# Altium project TI_RTB_integrated1.PrjPcb (part 1 of 2)
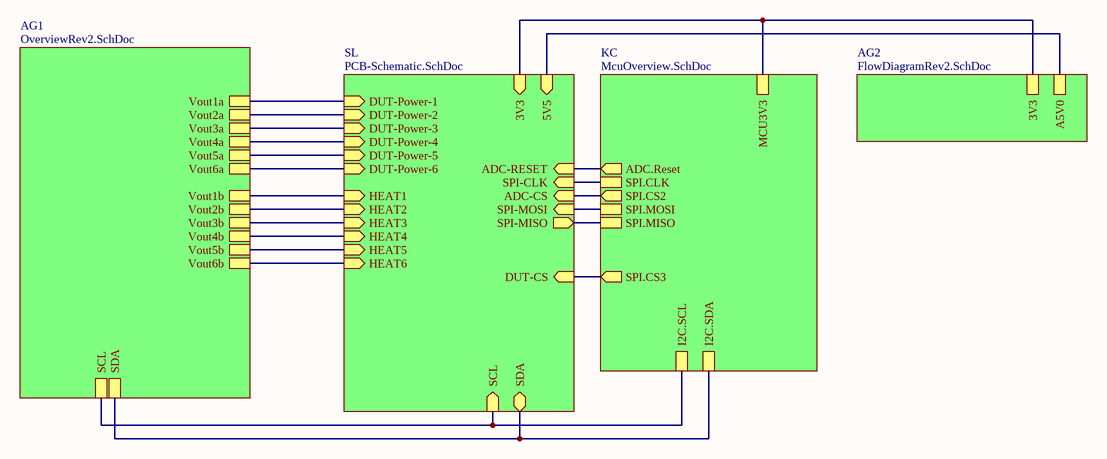
[diagram p0: overviewSchematic.SchDoc]
14 sheets, 185 parts. Net scope: hierarchical (ports join the sheet entries above them; power ports are global).
Board file: intPCB1.PcbDoc
Sheets:
  overviewSchematic.SchDoc
    KC = McuOverview.SchDoc
      U_EthernetSheet = EthernetSheet.SchDoc
      Designator = RadationTestBoardMCU.SchDoc
      Designator = PowerFilters.SchDoc
    SL = PCB-Schematic.SchDoc
      ADC = ADC.SchDoc
      VRB = VRB.SchDoc
      Current Sense = CurrentSense.SchDoc
      Heat Element = HeatElement.SchDoc
      Thermistors = Thermistor.SchDoc
      DUT1 = Headers.SchDoc
      DUT2 = Headers.SchDoc
      DUT3 = Headers.SchDoc
      DUT4 = Headers.SchDoc
      DUT5 = Headers.SchDoc
      DUT6 = Headers.SchDoc
      VOLT = ADC.SchDoc
      VRB = VRB.SchDoc
    AG2 = FlowDiagramRev2.SchDoc
    AG1 = OverviewRev2.SchDoc

## Sheet overviewSchematic.SchDoc
size A; SheetNumber: 1; SheetTotal: 14

### Sub-sheets
AG1 = OverviewRev2.SchDoc: Vout4a, Vout5a, Vout6a, Vout4b, Vout5b, Vout6b, Vout1a, Vout1b, Vout2a, Vout2b, Vout3b, Vout3a, SCL, SDA
AG2 = FlowDiagramRev2.SchDoc: 3V3, A5V0
KC = McuOverview.SchDoc: I2C.SDA, I2C.SCL, SPI.CS3 (out), MCU3V3, SPI.CLK, SPI.MISO, SPI.MOSI, ADC.Reset (out), SPI.CS2 (out)
SL = PCB-Schematic.SchDoc: DUT-Power-1 (in), DUT-Power-2 (in), DUT-Power-3 (in), DUT-Power-4 (in), DUT-Power-5 (in), DUT-Power-6 (in), HEAT1 (in), HEAT2 (in), HEAT3 (in), HEAT4 (in), HEAT5 (in), HEAT6 (in), ADC-CS (in), SPI-MOSI (in), SPI-MISO (out), ADC-RESET (in), SPI-CLK (in), SDA (bidir), SCL (in), DUT-CS (in), 3V3 (in), 5V5 (in)

### Nets
3V3: sheet KC/MCU3V3, sheet SL/3V3, sheet AG2/3V3
A5V0: sheet SL/DUT-Power-1, sheet SL/DUT-Power-2, sheet SL/DUT-Power-3, sheet SL/DUT-Power-4, sheet SL/DUT-Power-5, sheet SL/DUT-Power-6, sheet SL/5V5, sheet AG2/A5V0, sheet AG1/Vout4a, sheet AG1/Vout5a, sheet AG1/Vout6a, sheet AG1/Vout1a, sheet AG1/Vout2a, sheet AG1/Vout3a
Pow.SCL: sheet KC/I2C.SCL, sheet SL/SCL, sheet AG1/SCL
Pow.SDA: sheet KC/I2C.SDA, sheet SL/SDA, sheet AG1/SDA
NetADC_ADC_19: sheet KC/ADC.Reset, sheet SL/ADC-RESET
NetADC_ADC_20: sheet KC/SPI.CLK, sheet SL/SPI-CLK
NetADC_ADC_21: sheet KC/SPI.CS2, sheet SL/ADC-CS
NetADC_ADC_23: sheet KC/SPI.MISO, sheet SL/SPI-MISO
NetADC_ADC_24: sheet KC/SPI.MOSI, sheet SL/SPI-MOSI
NetADC_VOLT_21: sheet KC/SPI.CS3, sheet SL/DUT-CS
NetC121_1: sheet SL/HEAT1, sheet AG1/Vout1b
NetC122_1: sheet SL/HEAT2, sheet AG1/Vout2b
NetC123_1: sheet SL/HEAT3, sheet AG1/Vout3b
NetC124_1: sheet SL/HEAT4, sheet AG1/Vout4b
NetC125_1: sheet SL/HEAT5, sheet AG1/Vout5b
NetC126_1: sheet SL/HEAT6, sheet AG1/Vout6b

## Sheet McuOverview.SchDoc
size A; SheetNumber: 11; SheetTotal: 14
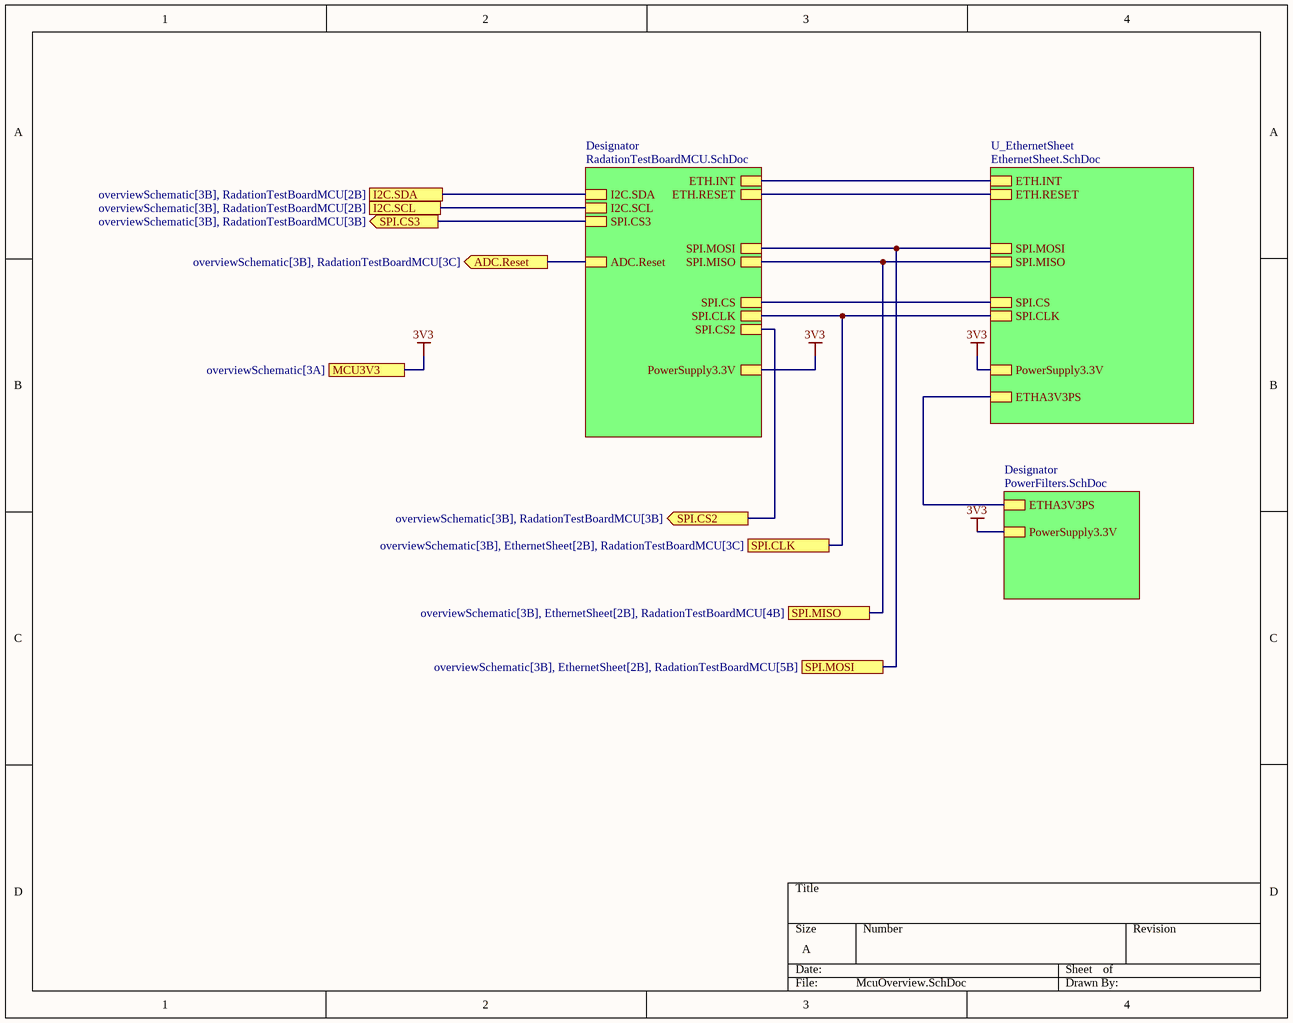
[diagram p1: McuOverview.SchDoc]

### Sub-sheets
Designator = RadationTestBoardMCU.SchDoc: I2C.SDA, I2C.SCL, SPI.MISO, SPI.CLK, ETH.INT, SPI.MOSI, SPI.CS, ETH.RESET, PowerSupply3.3V, SPI.CS2, SPI.CS3, ADC.Reset
Designator = PowerFilters.SchDoc: PowerSupply3.3V, ETHA3V3PS
U_EthernetSheet = EthernetSheet.SchDoc: ETH.INT, SPI.MOSI, SPI.MISO, SPI.CLK, SPI.CS, ETH.RESET, PowerSupply3.3V, ETHA3V3PS

### Ports
ADC.Reset (out, see overviewSchematic[3B], RadationTestBoardMCU[3C]), I2C.SCL (see overviewSchematic[3B], RadationTestBoardMCU[2B]), I2C.SDA (see overviewSchematic[3B], RadationTestBoardMCU[2B]), MCU3V3 (see overviewSchematic[3A]), SPI.CLK (see overviewSchematic[3B], EthernetSheet[2B], RadationTestBoardMCU[3C]), SPI.CS2 (out, see overviewSchematic[3B], RadationTestBoardMCU[3B]), SPI.CS3 (out, see overviewSchematic[3B], RadationTestBoardMCU[3B]), SPI.MISO (see overviewSchematic[3B], EthernetSheet[2B], RadationTestBoardMCU[4B]), SPI.MOSI (see overviewSchematic[3B], EthernetSheet[2B], RadationTestBoardMCU[5B])

### Nets
3V3: port MCU3V3, sheet U_EthernetSheet/PowerSupply3.3V, sheet Designator/PowerSupply3.3V, sheet Designator/PowerSupply3.3V
ETHA3V3: sheet U_EthernetSheet/ETHA3V3PS, sheet Designator/ETHA3V3PS
Pow.SCL: port I2C.SCL, sheet Designator/I2C.SCL
Pow.SDA: port I2C.SDA, sheet Designator/I2C.SDA
NetADC_ADC_19: port ADC.Reset, sheet Designator/ADC.Reset
NetADC_ADC_20: port SPI.CLK, sheet U_EthernetSheet/SPI.CLK, sheet Designator/SPI.CLK
NetADC_ADC_21: port SPI.CS2, sheet Designator/SPI.CS2
NetADC_ADC_23: port SPI.MISO, sheet U_EthernetSheet/SPI.MISO, sheet Designator/SPI.MISO
NetADC_ADC_24: port SPI.MOSI, sheet U_EthernetSheet/SPI.MOSI, sheet Designator/SPI.MOSI
NetADC_VOLT_21: port SPI.CS3, sheet Designator/SPI.CS3
NetU201_12: sheet U_EthernetSheet/SPI.CS, sheet Designator/SPI.CS
NetU201_30: sheet U_EthernetSheet/ETH.RESET, sheet Designator/ETH.RESET
NetU201_31: sheet U_EthernetSheet/ETH.INT, sheet Designator/ETH.INT

## Sheet EthernetSheet.SchDoc
size B; SheetNumber: 13; SheetTotal: 14
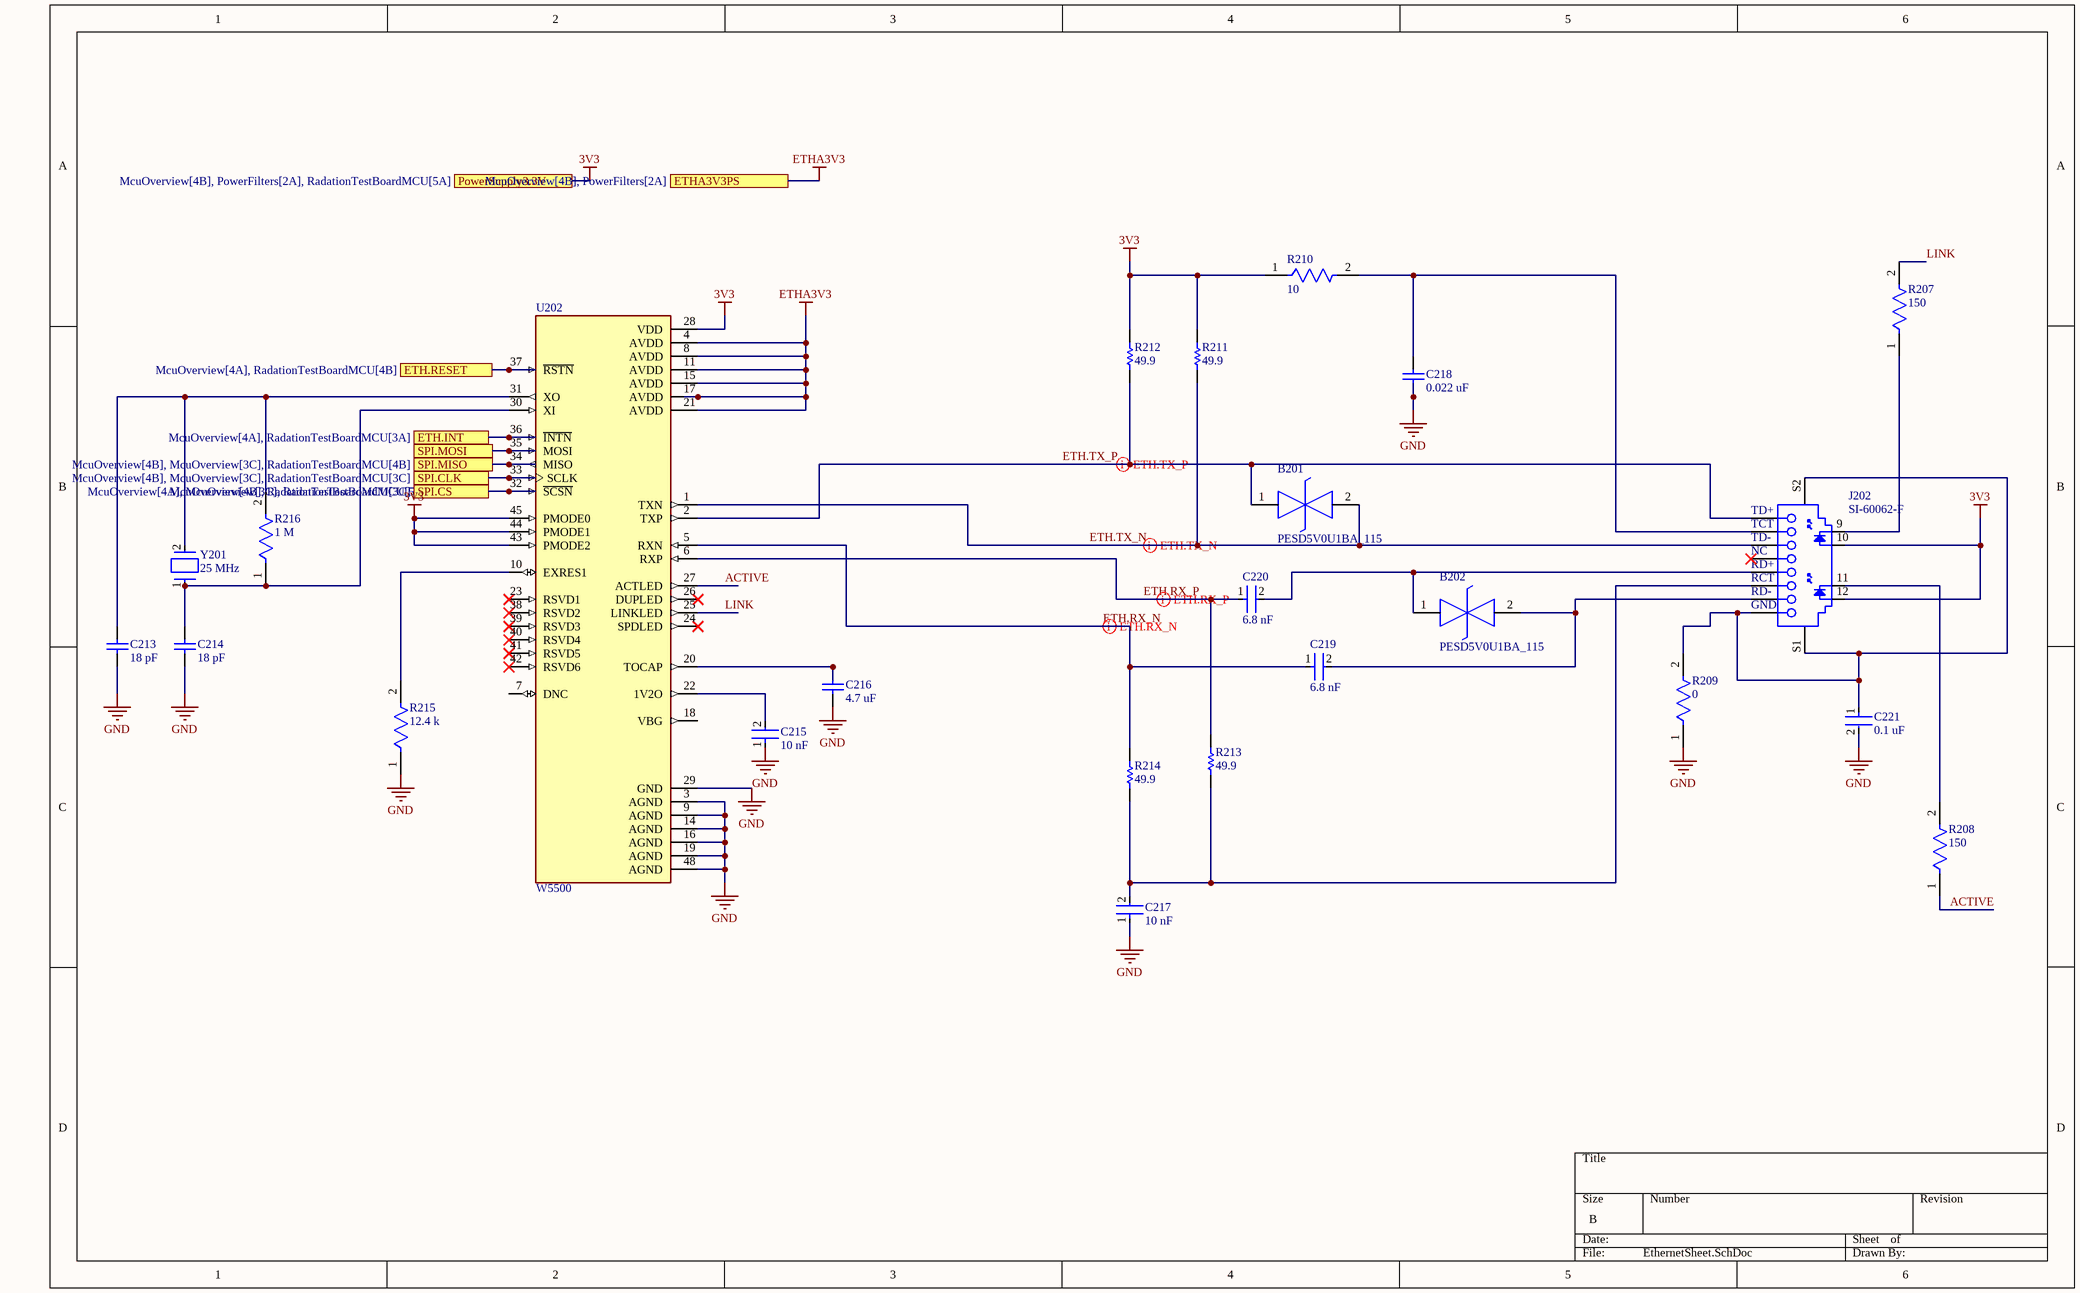
[diagram p2: EthernetSheet.SchDoc]

### Parts
B201  PESD5V0U1BA_115  [PESD5V0U1BA115]
B202  PESD5V0U1BA_115  [PESD5V0U1BA115]
C213  18 pF  [CAPC1608X90X35LL15T15]
C214  18 pF  [CAPC1608X90X35LL15T15]
C215  10 nF  [FP-0603-L_1_6_0_15-W_0_81-IPC_C]
C216  4.7 uF  [CAPC1608X87X35NL15T15]
C217  10 nF  [FP-0603-L_1_6_0_15-W_0_81-IPC_C]
C218  0.022 uF  [CAPC1608X92X38LL15T08]
C219  6.8 nF  [FP-CGA3E-0_3-0_1-IPC_A]
C220  6.8 nF  [FP-CGA3E-0_3-0_1-IPC_A]
C221  0.1 uF  [FP-CC0603-DA-IPC_A]
J202  SI-60062-F  [BELF-SI-60062-F_V]
R207  150  [FP-CRCW0603-e3-MFG]
R208  150  [FP-CRCW0603-e3-MFG]
R209  0  [FP-CRCW0402-e3-IPC_C]
R210  10  [FP-CRCW0603-e3-IPC_A]
R211  49.9  [RESC1609X50X30NL10T20]
R212  49.9  [RESC1609X50X30NL10T20]
R213  49.9  [RESC1609X50X30NL10T20]
R214  49.9  [RESC1609X50X30NL10T20]
R215  12.4 k  [FP-CRCW0603-e3-IPC_B]
R216  1 M  [FP-ERJ3EK-IPC_C]
U202  W5500  [QFP50P900X900X160-48N]
Y201  25 MHz  [FP-ABM3-MFG]

### Ports
ETH.INT (see McuOverview[4A], RadationTestBoardMCU[3A]), ETH.RESET (see McuOverview[4A], RadationTestBoardMCU[4B]), ETHA3V3PS (see McuOverview[4B], PowerFilters[2A]), PowerSupply3.3V (see McuOverview[4B], PowerFilters[2A], RadationTestBoardMCU[5A]), SPI.CLK (see McuOverview[4B], McuOverview[3C], RadationTestBoardMCU[3C]), SPI.CS (see McuOverview[4B], RadationTestBoardMCU[3C]), SPI.MISO (see McuOverview[4B], McuOverview[3C], RadationTestBoardMCU[4B]), SPI.MOSI (see McuOverview[4A], McuOverview[3C], RadationTestBoardMCU[5B])

### Nets
3V3: J202.10 J202.12 R210.1 R211.2 R212.2 U202.28(VDD) U202.43(PMODE2) U202.44(PMODE1) U202.45(PMODE0) ; port PowerSupply3.3V
ETHA3V3: U202.4(AVDD) U202.8(AVDD) U202.11(AVDD) U202.15(AVDD) U202.17(AVDD) U202.21(AVDD) ; port ETHA3V3PS
GND: C213.2 C214.1 C215.1 C216.1 C217.1 C218.1 C221.2 R209.1 R215.1 U202.3(AGND) U202.9(AGND) U202.14(AGND) U202.16(AGND) U202.19(AGND) U202.29(GND) U202.48(AGND)
ACTIVE: R208.1 U202.27(ACTLED)
ETH.RX_N: C219.1 R214.2 U202.5(RXN)
ETH.RX_P: C220.1 R213.2 U202.6(RXP)
ETH.TX_N: B201.2(K2) J202.3(TD-) R211.1 U202.1(TXN)
ETH.TX_P: B201.1(K1) J202.1(TD+) R212.1 U202.2(TXP)
LINK: R207.2 U202.25(LINKLED)
NetADC_ADC_20: U202.33(SCLK) ; port SPI.CLK
NetADC_ADC_23: U202.34(MISO) ; port SPI.MISO
NetADC_ADC_24: U202.35(MOSI) ; port SPI.MOSI
NetB202_1: B202.1(K1) C220.2 J202.5(RD+)
NetB202_2: B202.2(K2) C219.2 J202.7(RD-)
NetC213_1: C213.1 R216.2 U202.31(XO) Y201.2
NetC214_2: C214.2 R216.1 U202.30(XI) Y201.1
NetC215_2: C215.2 U202.22(1V2O)
NetC216_2: C216.2 U202.20(TOCAP)
NetC217_2: C217.2 J202.6(RCT) R213.1 R214.1
NetC218_2: C218.2 J202.2(TCT) R210.2
NetC221_1: C221.1 J202.8(GND) J202.S1 J202.S2 R209.2
NetJ202_9: J202.9 R207.1
NetJ202_11: J202.11 R208.2
NetR215_2: R215.2 U202.10(EXRES1)
NetU201_12: U202.32(~{SCSN}) ; port SPI.CS
NetU201_30: U202.37(~{RSTN}) ; port ETH.RESET
NetU201_31: U202.36(~{INTN}) ; port ETH.INT

Not connected (* = marked no-connect by the designer): J202 4(NC)*; U202 7(DNC) 18(VBG) 23(RSVD1)* 24(SPDLED)* 26(DUPLED)* 38(RSVD2)* 39(RSVD3)* 40(RSVD4)* 41(RSVD5)* 42(RSVD6)*

### Layout directives
differential pair: ETH.RX_N, ETH.RX_P, ETH.TX_N, ETH.TX_P

### Library data of the parts
B201 B202 = PESD5V0U1BA_115: PESDV0U1BA - Low capacitance bidirectional ESD protection diode; Manufacturer_Name: Nexperia; Manufacturer_Part_Number: PESD5V0U1BA,115; Geometry.Height: 1.1mm; Mouser Part Number: 771-PESD5V0U1BA115; Mouser Price/Stock: https://www.mouser.co.uk/ProductDetail/Nexperia/PESD5V0U1BA115?qs=LOCUfHb8d9tqw6h%2FD3HZHw%3D%3D; Datasheet Link: https://assets.nexperia.com/documents/data-sheet/PESD5V0U1BA.pdf
C213 C214 = CMP-2006-04592-1: 06035A180FAT2A; Manufacturer: AVX Interconnect / Elco; Part Number: 06035A180FAT2A
C215 C217 = CMP-2006-02076-2: CAP CER 10000PF 50V X7R 0603 06035C103KAT4A; Insulation Resistance: 100GR; Tolerance: 10%; Dissipation Factor: 2.5%; Capacitance: 10nF; Number of Pins: 2; Package Quantity: 15000; Voltage Rating (DC): 50V; Case Code (Imperial): 0603; Series: -; Depth: 0.81mm; Termination: SMD/SMT; Packaging: Tape and Reel; Length: 1.6mm; Radiation Hardening: No; REACH SVHC: No SVHC; Height: 0.9mm; Min Operating Temperature: -55°C; Voltage Rating: 50V; RoHS Compliant: Yes; Case Code (Metric): 1608; Width: 0.81mm; Lead Free: Lead Free; Construction: Flat; Case/Package: 0603; Voltage: 50V; Dielectric: X7R; Max Operating Temperature: 125°C; Mount: Surface Mount
C216 = CMP-2006-03238-1: C0603C475K8PACTU; Manufacturer: Kemet; Part Number: C0603C475K8PACTU
C218 = CMP-2006-01328-1: VJ0603Y223JXAAC; Manufacturer: Vitramon; Part Number: VJ0603Y223JXAAC
C219 C220 = CMP-08246-001772-1: Cap Ceramic 6.8nF 50V C0G 5% Pad SMD 0603 +125°C Automotive T/R CGA3E2C0G1H682J080AE
C221 = CMP-03422-001490-1: CAP CER 0.1UF 50V X7R 0603 CC0603JRX7R9BB104; Capacitance: 100nF; Tolerance: 5%; Number of Pins: 2; Depth: 0.8mm; Weight: 7.1E-05oz; Radiation Hardening: No; Case Code (Metric): 1608; Dielectric: X7R; Max Operating Temperature: 125°C; Voltage Rating (DC): 50V; Case/Package: 0603; Halogen Free: Halogen Free; Mount: Surface Mount; Lead Free: Lead Free; Termination: SMD/SMT; RoHS Compliant: Yes; Length: 1.6mm; Series: CC; Resistor Type: Ceramic; Case Code (Imperial): 0603; Construction: Flat; Width: 0.031inch; Height: 0.8mm; Voltage Rating: 50V; Min Operating Temperature: -55°C; Thickness: 0.035inch; Packaging: Tape and Reel
J202 = CMP-2000-07059-1: 1 Port RJ45 Magjack Connector with Yellow and Green LED, 10/100 Base-T, 12-Pin THD, RoHS, Tray; Manufacturer: Bel Fuse; Number of Ways: 8P4C; Gender: Female; Shield Type: STP; Connector Type: RJ45; Contact Plating: Gold; Mounting Type: ThroughHole; Datasheet Version: Rev. B0, 09/2008; Package Reference: SI-60062-F; Manufacturer URL: http://belfuse.com/; Package Description: 12-Pin Through Hole Device, Body 21.59 x 16.13 mm; Series: MagJack; Contact Material: CopperAlloy; Datasheet URL: http://belfuse.com/pdfs/SI-60062-F.pdf; Width: 17.98mm; Length: 15.21mm; Mounting Technology: ThroughHole; Depth: 21.59mm; Orientation: Straight
R207 R208 = CMP-2000-03913-2: RES Thick Film, 150Ω, 1%, 0.1W, 100ppm/°C, 0603 CRCW0603150RFKEA; Voltage Rating (DC): 75V; Resistance: 150R; Max Power Dissipation: 100mW; Features: Automotive AEC-Q200; Weight: 7.1E-05oz; Number of Terminations: 2; Temperature Coefficient: 100ppm/°C; Military Standard: Not; Length: 1.55mm; Min Operating Temperature: -55°C; Termination: SMD/SMT; Tolerance: 1%; Composition: Thick Film; Depth: 0.85mm; Max Operating Temperature: 155°C; Width: 0.033inch; Lead Free: Lead Free; Height: 0.45mm; Case Code (Metric): 1608; Package Quantity: 10; Case Code (Imperial): 0603; Voltage Rating: 75V; Radiation Hardening: No; Contact Plating: Tin; Mount: Surface Mount; Packaging: Tape and Reel; Power Rating: 100mW; Case/Package: 0603
R209 = CMP-2002-08122-2: RES Thick Film, 0Ω, 0.063W, 0402 CRCW04020000Z0ED; Tolerance: 5%; Max Power Dissipation: 63mW; Voltage Rating: 50V; Temperature Coefficient: 100ppm/°C; Resistance: 0mR; Contact Plating: Tin; Height: 0.35mm; Radiation Hardening: No; Features: Automotive AEC-Q200; Composition: Thick Film; Width: 0.5mm; Weight: 2.3E-05oz; Termination: SMD/SMT; Packaging: Tape and Reel; Mount: Surface Mount; Case Code (Metric): 1005; Military Standard: Not; Min Operating Temperature: -55°C; Number of Terminations: 2; Package Quantity: 1; Case Code (Imperial): 0402; Depth: 0.5mm; Max Operating Temperature: 155°C; Case/Package: 0402; Power Rating: 63mW; Lead Free: Lead Free; Voltage Rating (DC): 50V; Length: 1mm
R210 = CMP-2000-03845-2: RES Thick Film, 10Ω, 1%, 0.1W, 100ppm/°C, 0603 CRCW060310R0FKEA; Resistance: 10R; Voltage Rating (DC): 75V; Power Rating: 100mW; Depth: 0.85mm; Height: 0.45mm; Package Quantity: 10; Temperature Coefficient: 100ppm/°C; Weight: 7.1E-05oz; Case Code (Metric): 1608; Number of Terminations: 2; Features: Automotive AEC-Q200; Termination: SMD/SMT; Lead Free: Lead Free; Mount: Surface Mount; Number of Pins: 2; Tolerance: 1%; Max Power Dissipation: 100mW; Width: 0.033inch; Contact Plating: Tin; Case Code (Imperial): 0603; Max Operating Temperature: 155°C; Min Operating Temperature: -55°C; Voltage Rating: 75V; Length: 1.55mm; Case/Package: 0603; Composition: Thick Film; Packaging: Tape and Reel; Military Standard: Not
R211-R214 = CMP-2000-03399-1: CRCW060349R9FKEC 0603 49.9 ohm Resistor; Manufacturer: Vishay Dale; Part Number: CRCW060349R9FKEC
R215 = CMP-2000-03881-2: RES Thick Film, 12.4kΩ, 1%, 0.1W, 100ppm/°C, 0603 CRCW060312K4FKEA; Voltage Rating (DC): 75V; Resistance: 12.4kR; Power Rating: 100mW; Case Code (Metric): 1608; Contact Plating: Tin; Radiation Hardening: No; Packaging: Tape and Reel; Lead Free: Lead Free; Length: 1.55mm; Depth: 0.85mm; Width: 0.85mm; Package Quantity: 10; Composition: Thick Film; Number of Terminations: 2; Max Operating Temperature: 155°C; Min Operating Temperature: -55°C; Height: 0.45mm; Tolerance: 1%; Temperature Coefficient: 100ppm/°C; Number of Pins: 2; Case Code (Imperial): 0603; Features: Automotive AEC-Q200; Weight: 7.1E-05oz; Max Power Dissipation: 100mW; Voltage Rating: 75V; Military Standard: Not; Termination: SMD/SMT; Mount: Surface Mount; Case/Package: 0603
R216 = CMP-1012-00849-3: RES SMD 1M OHM 1% 1/10W 0603 ERJ-3EKF1004V; Resistance: 1MR; Voltage Rating: 75V; Temperature Coefficient: 100ppm/°C; Power Rating: 100mW; REACH SVHC: No SVHC; Radiation Hardening: No; Features: Automotive AEC-Q200; Case Code (Metric): 1608; Resistance Tolerance: 1%; Case/Package: 0603; Termination: SMD/SMT; Max Operating Temperature: 155°C; Tolerance: 1%; Size Code: 0603; Case Code (Imperial): 0603; Min Operating Temperature: -55°C; Number of Pins: 2; Mount: Surface Mount; Package Quantity: 1; Military Standard: Not; Voltage Rating (DC): 75V; Depth: 0.8mm; Packaging: Tape and Reel; Width: 0.8mm; Number of Terminations: 2; Length: 1.6mm; Height: 0.022inch; RoHS Compliant: Yes; Resistor Type: Thick Film; Contact Plating: Tin; Lead Free: Lead Free; Series: ERJ; Construction: Rectangular; Max Power Dissipation: 100mW
U202 = W5500: Hardwired TCP/IP embedded Ethernet controller; Availability: Unavailable; MP: W5500; Value: *; Price: None; Package: None
Y201 = CMP-2000-05729-2: Crystal 25MHz ±20ppm 18pF SMD-2 5mm x 3.2mm ABM3-25.000MHZ-B2-T; Insulation Resistance: 500MR; Frequency Stability: 50ppm; ESR (Equivalent Series Resistance): 30R; Operating Frequency: 25 MHz; Termination: SMD/SMT; REACH SVHC: Yes; Max Operating Temperature: 70°C; Packaging: Tape and Reel; Tolerance: 20ppm; Load Capacitance: 18pF; Depth: 3.2mm; Height: 0.051inch; Min Operating Temperature: -20°C; Length: 5mm; Mount: Surface Mount; Resistor Type: Ceramic; Width: 0.126inch; Case/Package: CSMD; Frequency Tolerance: 20ppm; Package Quantity: 1000; Number of Pins: 2; RoHS Compliant: Yes; Frequency: 25MHz; Series Resistance: 30R; Series: ABM3; Lead Free: Lead Free

## Sheet RadationTestBoardMCU.SchDoc
size B; SheetNumber: 12; SheetTotal: 14
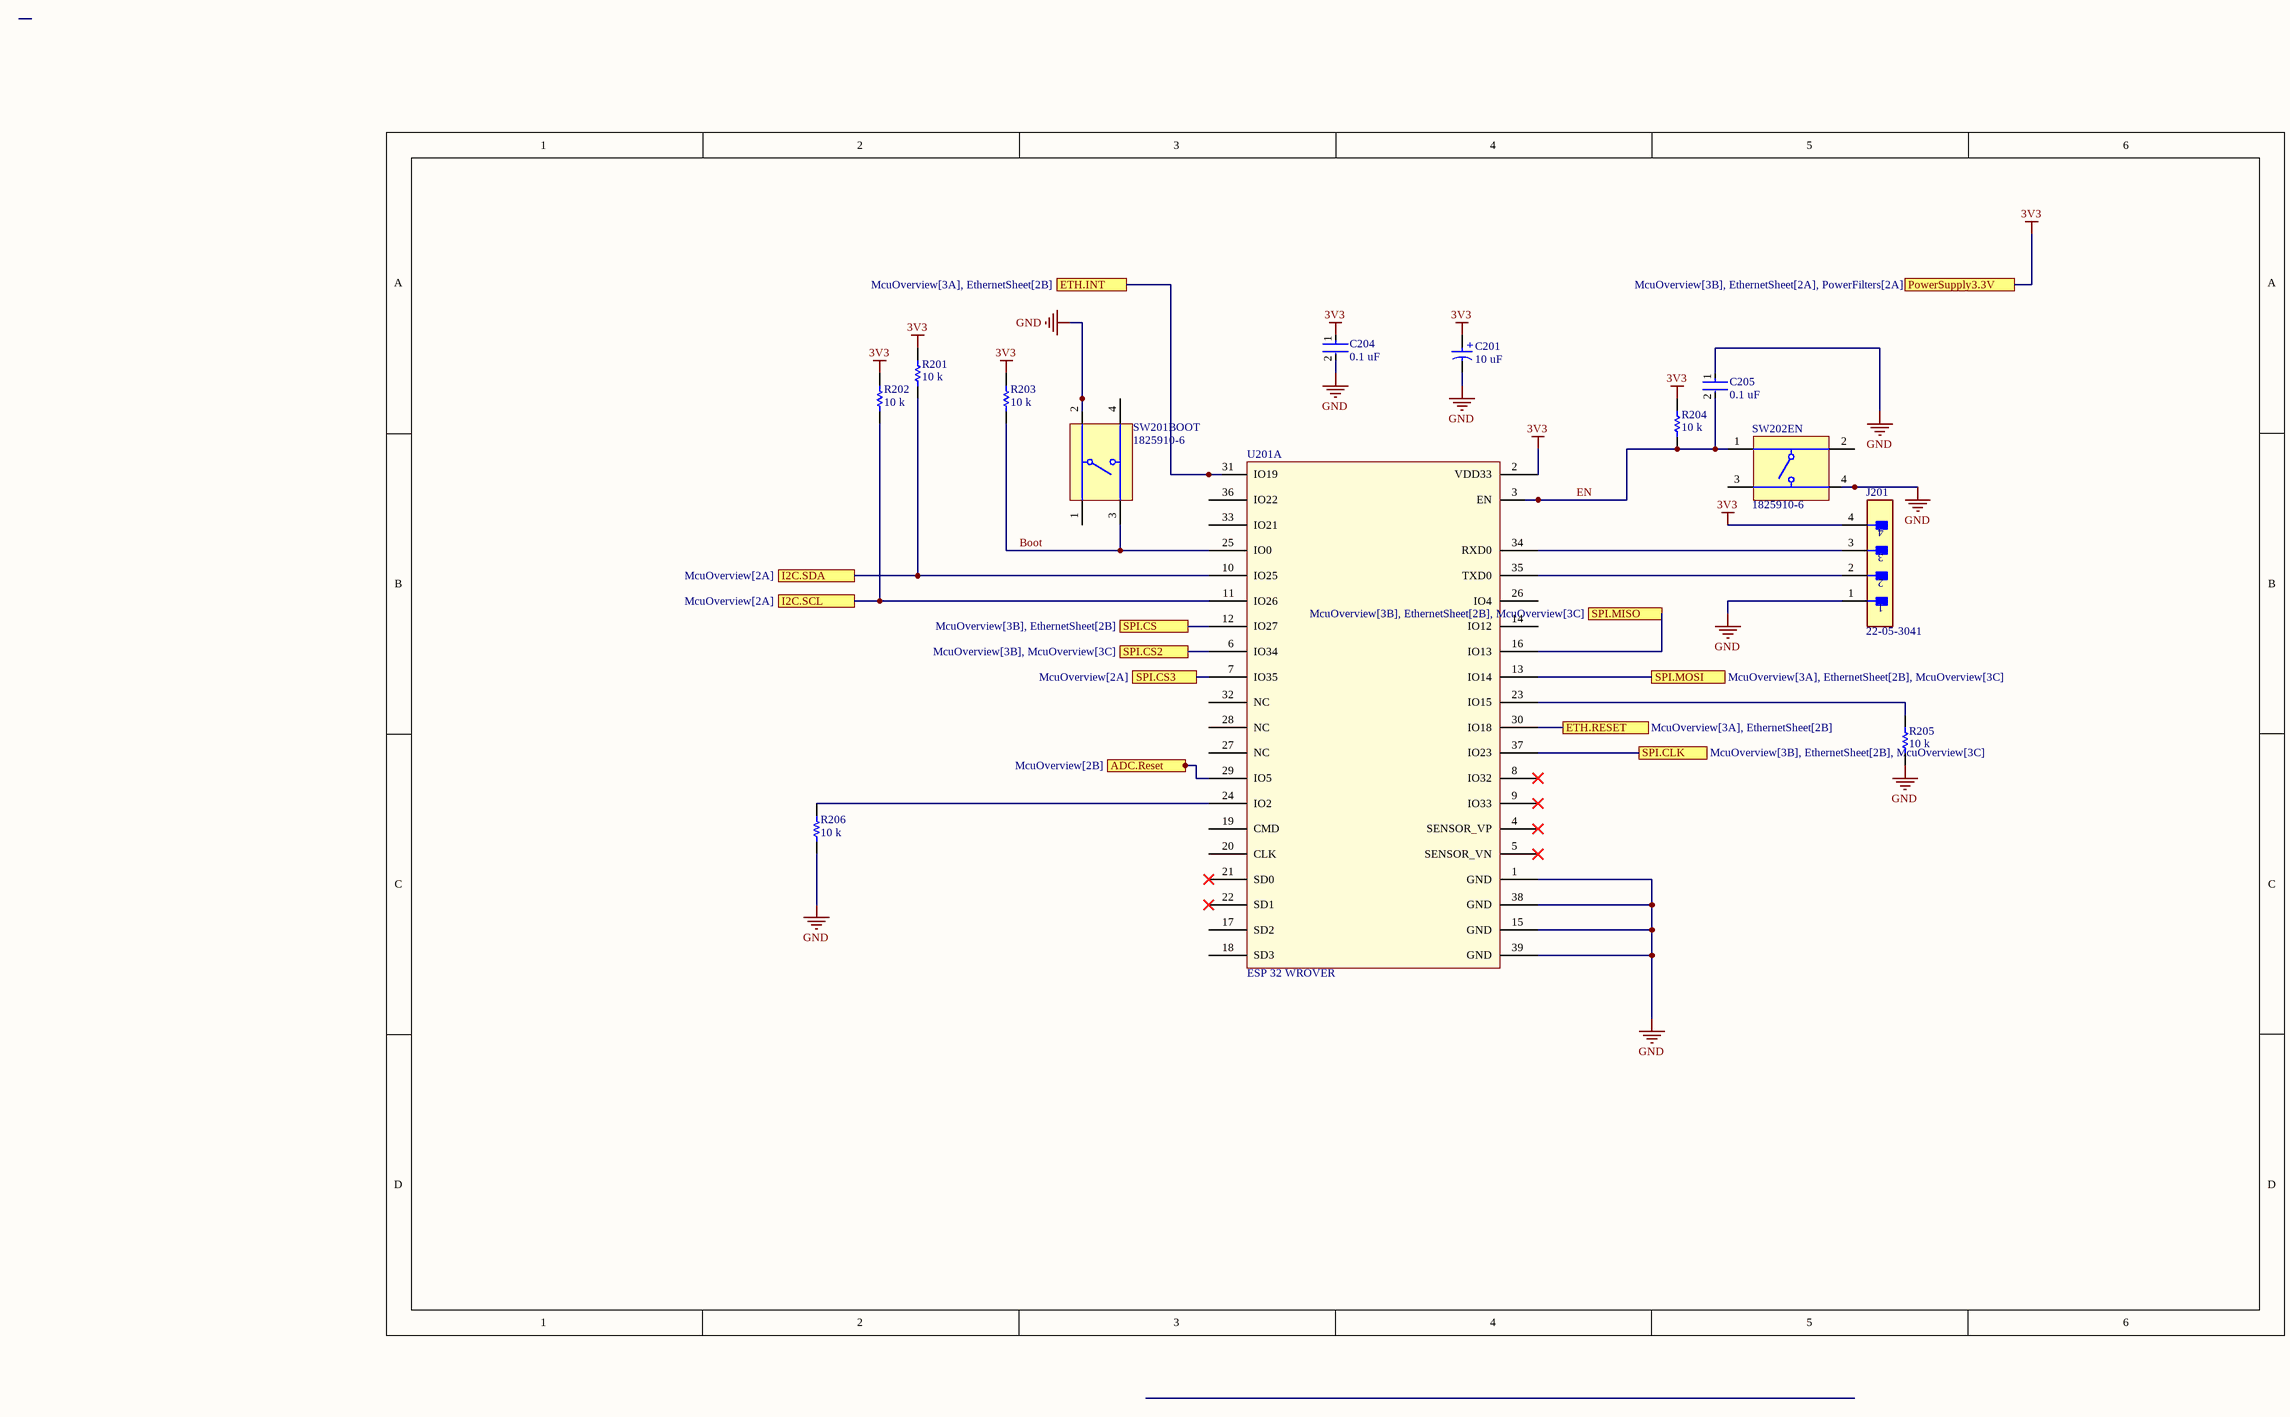
[diagram p3: RadationTestBoardMCU.SchDoc]

### Parts
C201  10 uF  [WCAP-HTG5_D6.3H8]
C204  0.1 uF  [FP-CC0603-DA-IPC_A]
C205  0.1 uF  [FP-CC0603-DA-IPC_A]
J201  22-05-3041  [FP-22-05-3041-MFG]
R201  10 k  [RESC2013X60X35NL10T20]
R202  10 k  [RESC2013X60X35NL10T20]
R203  10 k  [RESC2013X60X35NL10T20]
R204  10 k  [RESC2013X60X35NL10T20]
R205  10 k  [RESC2013X60X35NL10T20]
R206  10 k  [RESC2013X60X35NL10T20]
SW201BOOT  1825910-6  [TECO-1825910-6_V]
SW202EN  1825910-6  [TECO-1825910-6_V]
U201  ESP 32 WROVER  [PCBComponent_1]  (part A of 2)

### Ports
ADC.Reset (see McuOverview[2B]), ETH.INT (see McuOverview[3A], EthernetSheet[2B]), ETH.RESET (see McuOverview[3A], EthernetSheet[2B]), I2C.SCL (see McuOverview[2A]), I2C.SDA (see McuOverview[2A]), PowerSupply3.3V (see McuOverview[3B], EthernetSheet[2A], PowerFilters[2A]), SPI.CLK (see McuOverview[3B], EthernetSheet[2B], McuOverview[3C]), SPI.CS2 (see McuOverview[3B], McuOverview[3C]), SPI.CS3 (see McuOverview[2A]), SPI.CS (see McuOverview[3B], EthernetSheet[2B]), SPI.MISO (see McuOverview[3B], EthernetSheet[2B], McuOverview[3C]), SPI.MOSI (see McuOverview[3A], EthernetSheet[2B], McuOverview[3C])

### Nets
3V3: C201.1(P) C204.1 J201.4 R201.2 R202.2 R203.2 R204.2 U201.2(VDD33) ; port PowerSupply3.3V
GND: C201.2(N) C204.2 C205.1 J201.1 R205.1 R206.1 SW201BOOT.2 SW202EN.4 U201.1(GND) U201.15(GND) U201.38(GND) U201.39(GND)
Boot: R203.1 SW201BOOT.3 U201.25(IO0)
EN: C205.2 R204.1 SW202EN.1 U201.3(EN)
Pow.SCL: R202.1 U201.11(IO26) ; port I2C.SCL
Pow.SDA: R201.1 U201.10(IO25) ; port I2C.SDA
NetADC_ADC_19: U201.29(IO5) ; port ADC.Reset
NetADC_ADC_20: U201.37(IO23) ; port SPI.CLK
NetADC_ADC_21: U201.6(IO34) ; port SPI.CS2
NetADC_ADC_23: U201.16(IO13) ; port SPI.MISO
NetADC_ADC_24: U201.13(IO14) ; port SPI.MOSI
NetADC_VOLT_21: U201.7(IO35) ; port SPI.CS3
NetJ201_2: J201.2 U201.35(TXD0)
NetJ201_3: J201.3 U201.34(RXD0)
NetR205_2: R205.2 U201.23(IO15)
NetR206_2: R206.2 U201.24(IO2)
NetU201_12: U201.12(IO27) ; port SPI.CS
NetU201_30: U201.30(IO18) ; port ETH.RESET
NetU201_31: U201.31(IO19) ; port ETH.INT

Not connected (* = marked no-connect by the designer): SW201BOOT 1 4; SW202EN 2 3; U201 4(SENSOR_VP)* 5(SENSOR_VN)* 8(IO32)* 9(IO33)* 14(IO12) 17(SD2) 18(SD3) 19(CMD) 20(CLK) 21(SD0)* 22(SD1)* 26(IO4) 27(NC) 28(NC) 32(NC) 33(IO21) 36(IO22)

### Notes on the sheet
- (in symbol CMP-03913-134709123-1) +

### Library data of the parts
C201 = CMP-03913-134709123-1: 870575873001 Cap, 10Uf, 63V, Alu Elec, Hybrid, Rad Rohs Compliant: Yes 870575873001; Capacitance: 10µF; Pitch: 2.5mm; Hole Diameter: 900µm; ESR (Equivalent Series Resistance): 100mΩ; Leakage Current: 6.3µA; Ripple Current: 1.06A; NexarPartId: 134709123; Diameter: 6.3mm; Length: 8mm; Voltage Rating: 63V; Max Operating Temperature: 105°C; Min Operating Temperature: -55°C; RoHS: Compliant
C204 C205 = CMP-03422-001490-1: as C221 on sheet EthernetSheet; Number of Pins: 2; Depth: 0.8mm; Weight: 7.1E-05oz; Radiation Hardening: No; Case Code (Metric): 1608; Dielectric: X7R; Max Operating Temperature: 125°C; Voltage Rating (DC): 50V; Case/Package: 0603; Halogen Free: Halogen Free; Mount: Surface Mount; Lead Free: Lead Free; Termination: SMD/SMT; RoHS Compliant: Yes; Length: 1.6mm; Series: CC; Resistor Type: Ceramic; Case Code (Imperial): 0603; Construction: Flat; Width: 0.031inch; Height: 0.8mm; Voltage Rating: 50V; Min Operating Temperature: -55°C; Thickness: 0.035inch; Packaging: Tape and Reel
J201 = CMP-2000-05533-2: CONN HEADER R/A 4POS 2.54MM; Manufacturer: Molex; Current Rating: 4A; Conn Gender: Male; Number Of Contacts: 4; Conn Orientation: Right Angle; Voltage Rating: 500V; Number Of Rows: 1; Contact Material: Tin,Nickel; Temperature Range Low: -40°C; ComponentLink2Description: Datasheet; Automotive: No; Lead Free: Yes; ComponentLink2URL: https://www.molex.com/webdocs/datasheets/pdf/en-us/0022053041_PCB_HEADERS.pdf; Octopart: https://octopart.com/22-05-3041-molex-2579; Temperature: -40°C to +80°C; Height: 6.6mm; Device Class L3: unset; Temperature Range High: +80°C; Pitch: 2.54mm; Manufacturer Part Number: 22-05-3041; Device Class L2: Headers and Wire Housings; RoHS: TRUE; Footprint Url: https://www.molex.com/pdm_docs/sd/022053041_sd.pdf; Category: Conn; Digikey Description: CONN HEADER R/A 4POS 2.54MM; Device Class L1: Connectors; Package: 0
R201-R206 = CMP-1659-00013-4: Chip Resistor, 10 KOhm, +/- 1%, 0.125 W, -55 to 155 degC, 0805 (2012 Metric), RoHS, Tape and Reel RC0805FR-0710KL; Manufacturer: Yageo; Voltage Rating: 150 V; Mount: Surface Mount; ComponentLink1Description: Manufacturer URL; ComponentLink2URL: http://www.yageo.com/documents/recent/PYu-RC_Group_51_RoHS_L_04.pdf; Pins: 2; Length: 2 mm; Min Operating Temperature: -55 degC; Height: 0.5 mm; Mounting Technology: Surface Mount; RoHSCompliant: true; REACH SVHC: No SVHC; ComponentLink1URL: http://www.yageo.com/; Max Operating Temperature: 155 degC; PackageReference: 0805; DatasheetVersion: Rev. 4, 02/2016; Package Quantity: 5000; Packaging: Tape and Reel; ComponentLink2Description: Datasheet; PackageDescription: 2-Pin Surface Mounted Device, Body 2 x 1.25 mm
SW201BOOT SW202EN = CMP-1684-00021-1: Tact Switch, SPST-NO, 0.05 A, -35 to 85 degC, 4-Pin THD, RoHS, Bulk; Manufacturer: TE Connectivity; Maximum Contact Resistance: 100mOhm; Mechanical Life: 100000Cycles; Bushing Type: Unthreaded; Switch Configuration: OFF(ON); Maximum DC Voltage Rating: 24V; Contact Rating @ Voltage: 0.05A@24VDC; Actuator Color: Black; Body Orientation: Straight; Function: MomentaryContact; Illumination: N/R; Actuator Style: RoundButton; Actuator Material: PolybutyleneTerephthalate; Dielectric Strength: 500VAC; Pole Throw Configuration: SPST; Actuator Length: 1.4mm; Product Weight: N/A; Contact Material: CopperAlloy; Housing Material: N/A; Terminal Type: PCPins; Minimum Insulation Resistance: 100MOhm; Package Description: 4-Pin Through Hole Device, Body 5.99 x 5.99 mm, Pitch 6.5 mm; Part No: 1825910-6; Package Reference: THD; Base Material: N/A; Manufacturer URL: http://www.te.com; Contact Plating: Silver; RoHS: Yes; Datasheet Version: Rev. C9; Electrical Life: 100000Cycles; Maximum AC Voltage Rating: N/A; Thread Size: N/R; Operating Temperature: -35to85C; Mounting: ThroughHole; Dimension: 5.99x5mm; Datasheet URL: http://www.te.com/commerce/DocumentDelivery/DDEController?Action=showdoc&DocId=Customer+Drawing%7F1825910%7FC9%7Fpdf%7FEnglish%7FENG_CD_1825910_C9.pdf%7F1825910-6; Family: 1825910; Seal Location: N/A; Seal Description: N/A; Packaging: N/A

## Sheet PowerFilters.SchDoc
size A; SheetNumber: 14; SheetTotal: 14
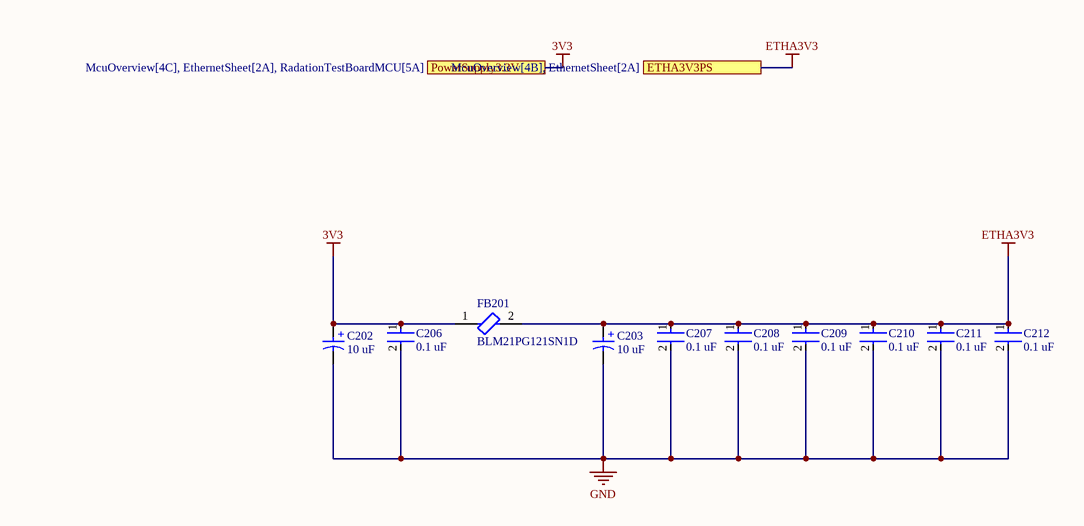
[diagram p4: PowerFilters.SchDoc]

### Parts
C202  10 uF  [WCAP-HTG5_D6.3H8]
C203  10 uF  [WCAP-HTG5_D6.3H8]
C206  0.1 uF  [FP-CC0603-DA-IPC_A]
C207  0.1 uF  [FP-CC0603-DA-IPC_A]
C208  0.1 uF  [FP-CC0603-DA-IPC_A]
C209  0.1 uF  [FP-CC0603-DA-IPC_A]
C210  0.1 uF  [FP-CC0603-DA-IPC_A]
C211  0.1 uF  [FP-CC0603-DA-IPC_A]
C212  0.1 uF  [FP-CC0603-DA-IPC_A]
FB201  BLM21PG121SN1D  [FP-BLM21-0_2-t0_85-e0_5-d-IPC_C]

### Ports
ETHA3V3PS (see McuOverview[4B], EthernetSheet[2A]), PowerSupply3.3V (see McuOverview[4C], EthernetSheet[2A], RadationTestBoardMCU[5A])

### Nets
3V3: C202.1(P) C206.1 FB201.1 ; port PowerSupply3.3V
ETHA3V3: C203.1(P) C207.1 C208.1 C209.1 C210.1 C211.1 C212.1 FB201.2 ; port ETHA3V3PS
GND: C202.2(N) C203.2(N) C206.2 C207.2 C208.2 C209.2 C210.2 C211.2 C212.2

### Notes on the sheet
- (in symbol CMP-03913-134709123-1) +

### Library data of the parts
C202 C203 = CMP-03913-134709123-1: as C201 on sheet RadationTestBoardMCU; NexarPartId: 134709123; Diameter: 6.3mm; Length: 8mm; Voltage Rating: 63V; Max Operating Temperature: 105°C; Min Operating Temperature: -55°C; RoHS: Compliant
C206-C212 = CMP-03422-001490-1: as C221 on sheet EthernetSheet; Number of Pins: 2; Depth: 0.8mm; Weight: 7.1E-05oz; Radiation Hardening: No; Case Code (Metric): 1608; Dielectric: X7R; Max Operating Temperature: 125°C; Voltage Rating (DC): 50V; Case/Package: 0603; Halogen Free: Halogen Free; Mount: Surface Mount; Lead Free: Lead Free; Termination: SMD/SMT; RoHS Compliant: Yes; Length: 1.6mm; Series: CC; Resistor Type: Ceramic; Case Code (Imperial): 0603; Construction: Flat; Width: 0.031inch; Height: 0.8mm; Voltage Rating: 50V; Min Operating Temperature: -55°C; Thickness: 0.035inch; Packaging: Tape and Reel
FB201 = CMP-0686-00612-3: Chip Ferrite Bead, 0805, 120Ω @ 100MHz, 0.03Ω, 25%, 3A; Impedance: 120R; Number of Circuits: 1; Material: Steel; DC Resistance (DCR): 30mR; Package Quantity: 1; Lead Free: Lead Free; Width: 1.25mm; Number of Pins: 2; Depth: 1.25mm; Case Code (Imperial): 0805; Tolerance: 25%; Current Rating: 3A; Test Frequency: 100MHz; Length: 2mm; Min Operating Temperature: -55°C; Max Current Rating: 3A; REACH SVHC: No SVHC; Series: BLM21P; Height: 0.85mm; Max DC Current: 3A; Termination: SMD/SMT; Max Operating Temperature: 125°C; Number of Lines: 1; Case/Package: 0805; RoHS Compliant: Yes; Packaging: Tape and Reel; Case Code (Metric): 2012; DC Resistance-Max: 30mR

## Sheet PCB-Schematic.SchDoc
size B; SheetNumber: 2; SheetTotal: 14
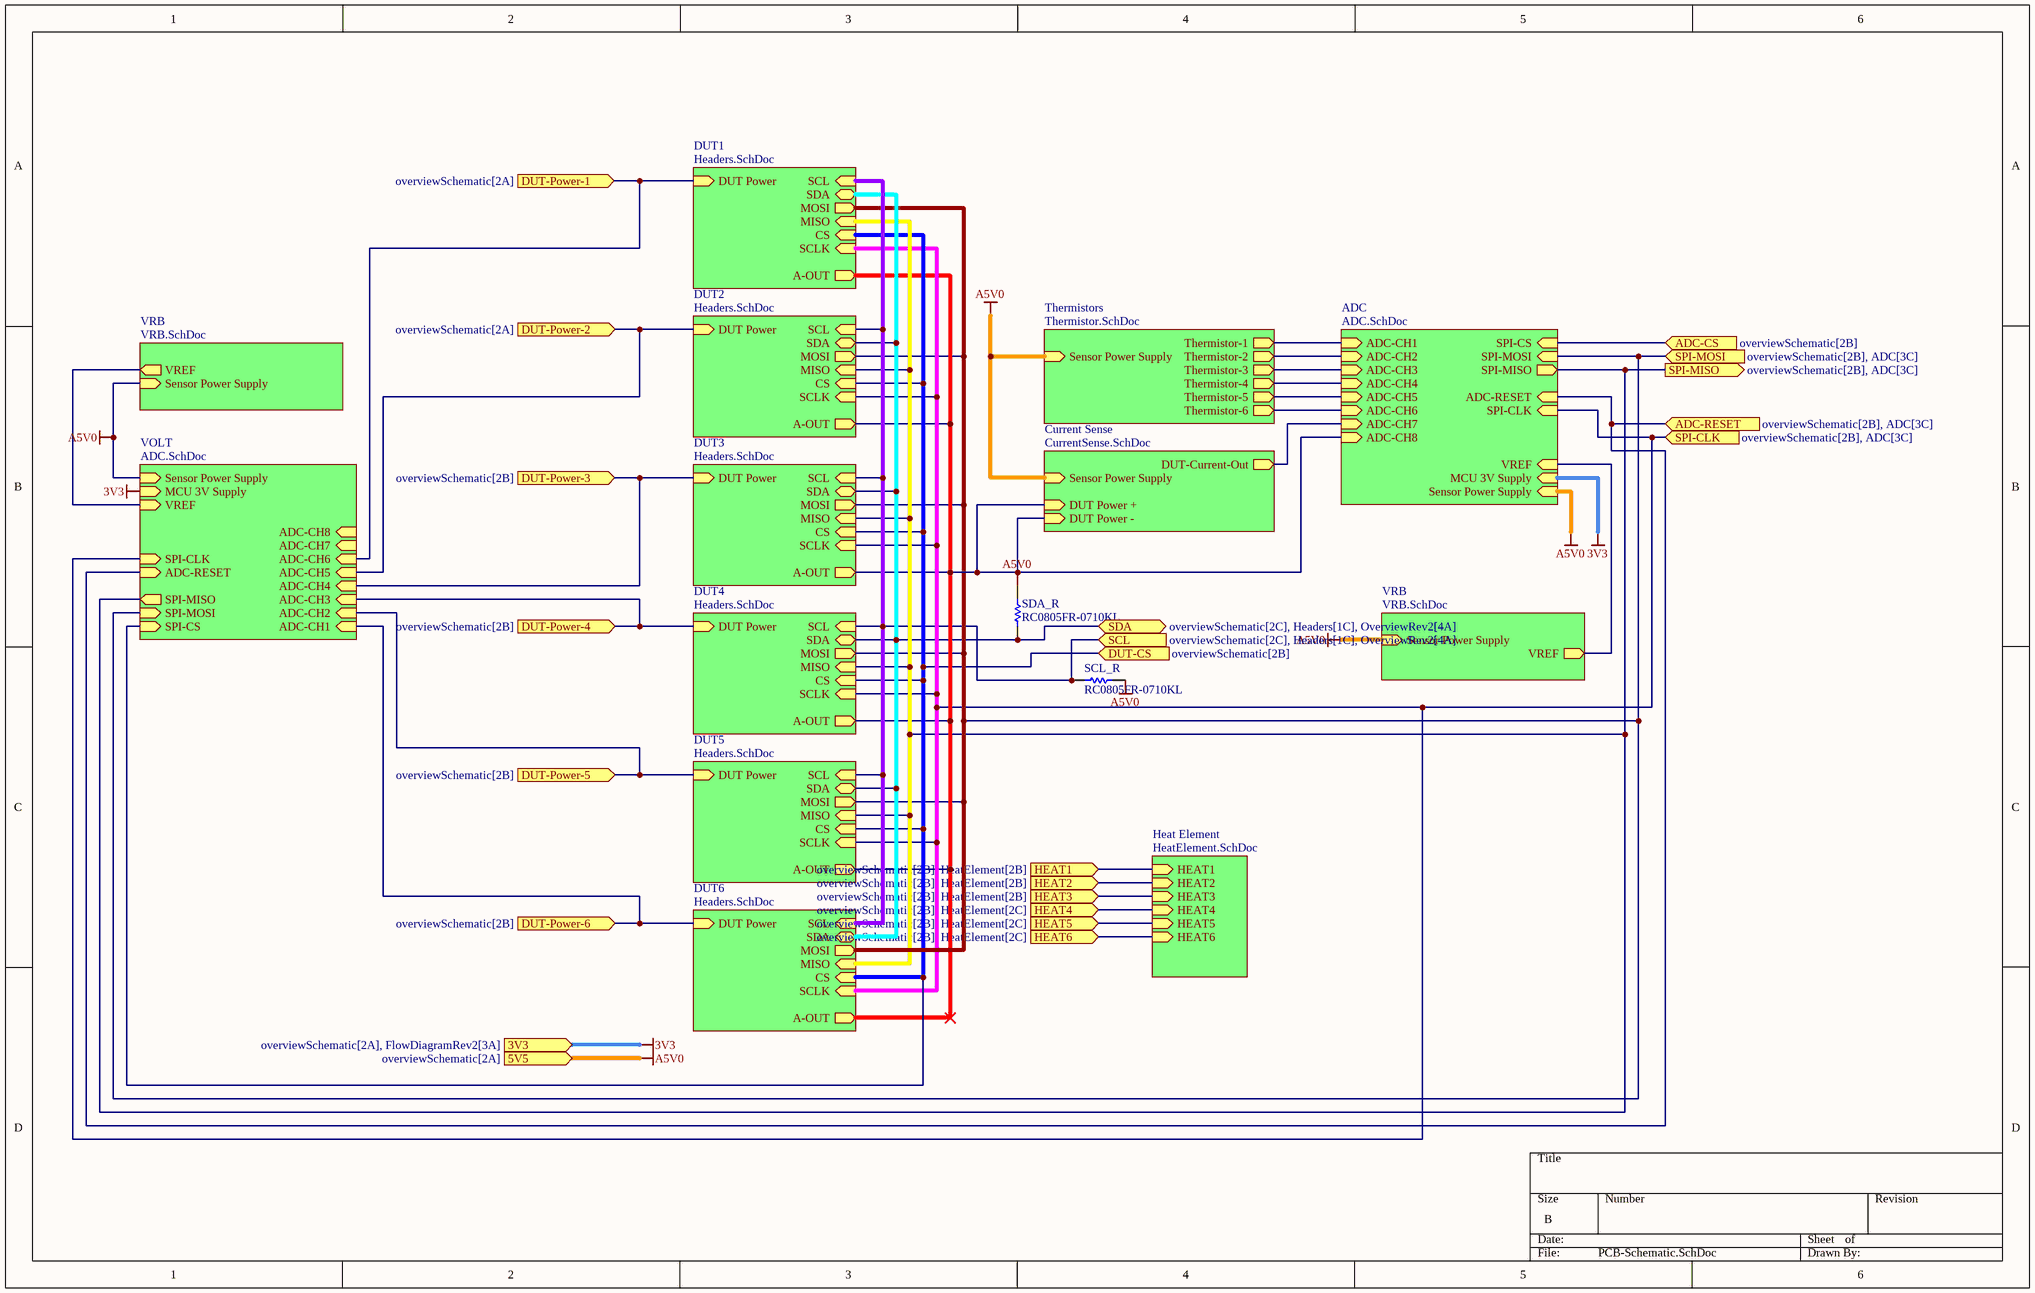
[diagram p5: PCB-Schematic.SchDoc]

### Parts
SCL_R  RC0805FR-0710KL  [RESC2013X60X35NL10T20]
SDA_R  RC0805FR-0710KL  [RESC2013X60X35NL10T20]

### Sub-sheets
ADC = ADC.SchDoc: ADC-CH1 (in), ADC-CH2 (in), ADC-CH3 (in), ADC-CH4 (in), ADC-CH5 (in), ADC-CH6 (in), SPI-CLK (in), SPI-MOSI (in), SPI-MISO (out), SPI-CS (in), ADC-RESET (in), ADC-CH7 (in), Sensor Power Supply (in), MCU 3V Supply (in), VREF (in), ADC-CH8 (in)
Current Sense = CurrentSense.SchDoc: DUT Power + (in), DUT Power - (in), DUT-Current-Out (out), Sensor Power Supply (in)
DUT1 = Headers.SchDoc: SCL (in), SDA (bidir), CS (in), SCLK (in), A-OUT (out), DUT Power (in), MOSI (out), MISO (in)
DUT2 = Headers.SchDoc: SCL (in), SDA (bidir), CS (in), SCLK (in), A-OUT (out), DUT Power (in), MOSI (out), MISO (in)
DUT3 = Headers.SchDoc: SCL (in), SDA (bidir), CS (in), SCLK (in), A-OUT (out), DUT Power (in), MOSI (out), MISO (in)
DUT4 = Headers.SchDoc: SCL (in), SDA (bidir), CS (in), SCLK (in), A-OUT (out), DUT Power (in), MOSI (out), MISO (in)
DUT5 = Headers.SchDoc: SCL (in), SDA (bidir), CS (in), SCLK (in), A-OUT (out), DUT Power (in), MOSI (out), MISO (in)
DUT6 = Headers.SchDoc: SCL (in), SDA (bidir), CS (in), SCLK (in), A-OUT (out), DUT Power (in), MOSI (out), MISO (in)
Heat Element = HeatElement.SchDoc: HEAT1 (in), HEAT2 (in), HEAT3 (in), HEAT4 (in), HEAT5 (in), HEAT6 (in)
Thermistors = Thermistor.SchDoc: Thermistor-6 (out), Thermistor-5 (out), Thermistor-1 (out), Thermistor-2 (out), Thermistor-3 (out), Thermistor-4 (out), Sensor Power Supply (in)
VOLT = ADC.SchDoc: ADC-CH1 (in), ADC-CH2 (in), ADC-CH3 (in), ADC-CH4 (in), ADC-CH5 (in), ADC-CH6 (in), SPI-CLK (in), SPI-MOSI (in), SPI-MISO (out), SPI-CS (in), ADC-RESET (in), ADC-CH7 (in), Sensor Power Supply (in), MCU 3V Supply (in), VREF (in), ADC-CH8 (in)
VRB = VRB.SchDoc: Sensor Power Supply (in), VREF (out)
VRB = VRB.SchDoc: Sensor Power Supply (in), VREF (out)

### Ports
3V3 (in, see overviewSchematic[2A], FlowDiagramRev2[3A]), 5V5 (in, see overviewSchematic[2A]), ADC-CS (in, see overviewSchematic[2B]), ADC-RESET (in, see overviewSchematic[2B], ADC[3C]), DUT-CS (in, see overviewSchematic[2B]), DUT-Power-1 (in, see overviewSchematic[2A]), DUT-Power-2 (in, see overviewSchematic[2A]), DUT-Power-3 (in, see overviewSchematic[2B]), DUT-Power-4 (in, see overviewSchematic[2B]), DUT-Power-5 (in, see overviewSchematic[2B]), DUT-Power-6 (in, see overviewSchematic[2B]), HEAT1 (in, see overviewSchematic[2B], HeatElement[2B]), HEAT2 (in, see overviewSchematic[2B], HeatElement[2B]), HEAT3 (in, see overviewSchematic[2B], HeatElement[2B]), HEAT4 (in, see overviewSchematic[2B], HeatElement[2C]), HEAT5 (in, see overviewSchematic[2B], HeatElement[2C]), HEAT6 (in, see overviewSchematic[2B], HeatElement[2C]), SCL (in, see overviewSchematic[2C], Headers[1C], OverviewRev2[4A]), SDA (bidir, see overviewSchematic[2C], Headers[1C], OverviewRev2[4A]), SPI-CLK (in, see overviewSchematic[2B], ADC[3C]), SPI-MISO (out, see overviewSchematic[2B], ADC[3C]), SPI-MOSI (in, see overviewSchematic[2B], ADC[3C])

### Nets
3V3: port 3V3, sheet ADC/MCU 3V Supply, sheet VOLT/MCU 3V Supply
A5V0: SCL_R.2 SDA_R.2 ; port DUT-Power-1, port DUT-Power-2, port DUT-Power-3, port DUT-Power-4, port DUT-Power-5, port DUT-Power-6, port 5V5, sheet ADC/Sensor Power Supply, sheet VRB/Sensor Power Supply, sheet Current Sense/Sensor Power Supply, sheet Thermistors/Sensor Power Supply, sheet DUT1/DUT Power, sheet DUT2/DUT Power, sheet DUT3/DUT Power, sheet DUT4/DUT Power, sheet DUT5/DUT Power, sheet DUT6/DUT Power, sheet VOLT/ADC-CH1, sheet VOLT/ADC-CH2, sheet VOLT/ADC-CH3, sheet VOLT/ADC-CH4, sheet VOLT/ADC-CH5, sheet VOLT/ADC-CH6, sheet VOLT/Sensor Power Supply, sheet VRB/Sensor Power Supply
Pow.SCL: SCL_R.1 ; port SCL, sheet DUT1/SCL, sheet DUT2/SCL, sheet DUT3/SCL, sheet DUT4/SCL, sheet DUT5/SCL, sheet DUT6/SCL
Pow.SDA: SDA_R.1 ; port SDA, sheet DUT1/SDA, sheet DUT2/SDA, sheet DUT3/SDA, sheet DUT4/SDA, sheet DUT5/SDA, sheet DUT6/SDA
NetTHERM1_2: sheet ADC/ADC-CH6, sheet Thermistors/Thermistor-6
NetTHERM2_2: sheet ADC/ADC-CH5, sheet Thermistors/Thermistor-5
NetTHERM4_2: sheet ADC/ADC-CH3, sheet Thermistors/Thermistor-3
NetTHERM5_2: sheet ADC/ADC-CH2, sheet Thermistors/Thermistor-2
NetTHERM6_2: sheet ADC/ADC-CH1, sheet Thermistors/Thermistor-1
NetADC_ADC_1: sheet ADC/ADC-CH7, sheet Current Sense/DUT-Current-Out
NetADC_ADC_2: sheet ADC/ADC-CH8, sheet Current Sense/DUT Power +, sheet Current Sense/DUT Power -, sheet DUT1/A-OUT, sheet DUT2/A-OUT, sheet DUT3/A-OUT, sheet DUT4/A-OUT, sheet DUT5/A-OUT, sheet DUT6/A-OUT
NetADC_ADC_6: sheet ADC/VREF, sheet VRB/VREF
NetADC_ADC_10: sheet ADC/ADC-CH4, sheet Thermistors/Thermistor-4
NetADC_ADC_19: port ADC-RESET, sheet ADC/ADC-RESET, sheet VOLT/ADC-RESET
NetADC_ADC_20: port SPI-CLK, sheet ADC/SPI-CLK, sheet DUT1/SCLK, sheet DUT2/SCLK, sheet DUT3/SCLK, sheet DUT4/SCLK, sheet DUT5/SCLK, sheet DUT6/SCLK, sheet VOLT/SPI-CLK
NetADC_ADC_21: port ADC-CS, sheet ADC/SPI-CS
NetADC_ADC_23: port SPI-MISO, sheet ADC/SPI-MISO, sheet DUT1/MISO, sheet DUT2/MISO, sheet DUT3/MISO, sheet DUT4/MISO, sheet DUT5/MISO, sheet DUT6/MISO, sheet VOLT/SPI-MISO
NetADC_ADC_24: port SPI-MOSI, sheet ADC/SPI-MOSI, sheet DUT1/MOSI, sheet DUT2/MOSI, sheet DUT3/MOSI, sheet DUT4/MOSI, sheet DUT5/MOSI, sheet DUT6/MOSI, sheet VOLT/SPI-MOSI
NetADC_VOLT_6: sheet VOLT/VREF, sheet VRB/VREF
NetADC_VOLT_21: port DUT-CS, sheet DUT1/CS, sheet DUT2/CS, sheet DUT3/CS, sheet DUT4/CS, sheet DUT5/CS, sheet DUT6/CS, sheet VOLT/SPI-CS
NetC121_1: port HEAT1, sheet Heat Element/HEAT1
NetC122_1: port HEAT2, sheet Heat Element/HEAT2
NetC123_1: port HEAT3, sheet Heat Element/HEAT3
NetC124_1: port HEAT4, sheet Heat Element/HEAT4
NetC125_1: port HEAT5, sheet Heat Element/HEAT5
NetC126_1: port HEAT6, sheet Heat Element/HEAT6

### Library data of the parts
SCL_R SDA_R = RESIST 0805: Chip Resistor, 10 KOhm, +/- 1%, 0.125 W, -55 to 155 degC, 0805 (2012 Metric), RoHS, Tape and Reel; Manufacturer: Yageo; Voltage Rating: 150 V; Mount: Surface Mount; ComponentLink1Description: Manufacturer URL; ComponentLink2URL: http://www.yageo.com/documents/recent/PYu-RC_Group_51_RoHS_L_04.pdf; Pins: 2; Length: 2 mm; Min Operating Temperature: -55 degC; Height: 0.5 mm; Mounting Technology: Surface Mount; RoHSCompliant: true; REACH SVHC: No SVHC; ComponentLink1URL: http://www.yageo.com/; Max Operating Temperature: 155 degC; PackageReference: 0805; DatasheetVersion: Rev. 4, 02/2016; Package Quantity: 5000; Packaging: Tape and Reel; ComponentLink2Description: Datasheet; PackageDescription: 2-Pin Surface Mounted Device, Body 2 x 1.25 mm

## Sheet ADC.SchDoc
size A; SheetNumber: 5; SheetTotal: 14
Used 2 times, as channels SL/ADC, SL/VOLT. Parts and nets are listed once, with the designators drawn on the sheet.
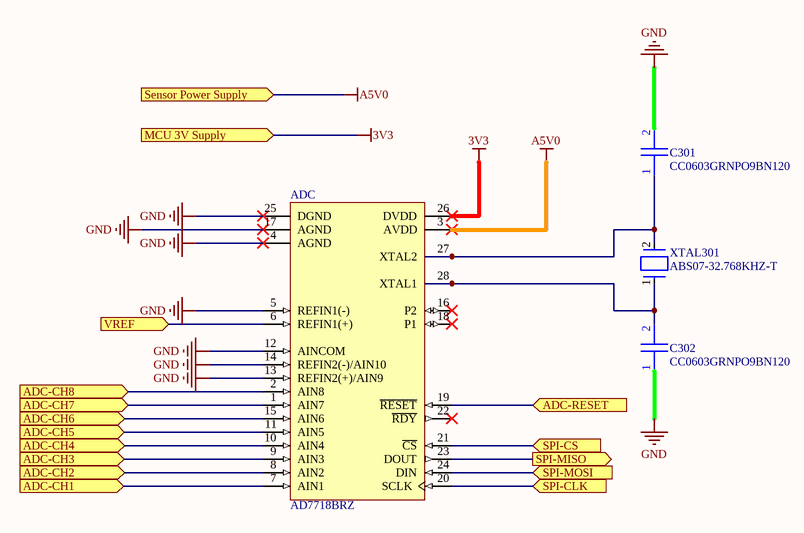
[diagram p6: ADC.SchDoc]

### Parts
ADC  AD7718BRZ  [RW-28_L]
C301  CC0603GRNPO9BN120  [CC0603GRNPO9BN120]
C302  CC0603GRNPO9BN120  [CC0603GRNPO9BN120]
XTAL301  ABS07-32.768KHZ-T  [FP-ABS07-MFG]

### Ports
ADC-CH1 (in, see PCB-Schematic[3A]), ADC-CH2 (in, see PCB-Schematic[3A]), ADC-CH3 (in, see PCB-Schematic[3B]), ADC-CH4 (in, see PCB-Schematic[3B]), ADC-CH5 (in, see PCB-Schematic[3B]), ADC-CH6 (in, see PCB-Schematic[3B]), ADC-CH7 (in, see PCB-Schematic[3B]), ADC-CH8 (in, see PCB-Schematic[3B]), ADC-RESET (in, see PCB-Schematic[4B]), MCU 3V Supply (in, see PCB-Schematic[4B]), Sensor Power Supply (in, see PCB-Schematic[4B], CurrentSense[2B], Thermistor[1A], VRB[2B]), SPI-CLK (in, see PCB-Schematic[4B]), SPI-CS (in, see PCB-Schematic[4A]), SPI-MISO (out, see PCB-Schematic[4B]), SPI-MOSI (in, see PCB-Schematic[4A]), VREF (in, see PCB-Schematic[4B], VRB[4C])

### Nets
3V3: ADC.26(DVDD) ; port MCU 3V Supply
A5V0: ADC.3(AVDD) ; port Sensor Power Supply
GND: ADC.4(AGND) ADC.5(REFIN1(-)) ADC.12(AINCOM) ADC.13(REFIN2(+)/AIN9) ADC.14(REFIN2(-)/AIN10) ADC.17(AGND) ADC.25(DGND) C301.2 C302.1
ADC-CH1: ADC.7(AIN1) ; port ADC-CH1
ADC-CH2: ADC.8(AIN2) ; port ADC-CH2
ADC-CH3: ADC.9(AIN3) ; port ADC-CH3
ADC-CH4: ADC.10(AIN4) ; port ADC-CH4
ADC-CH5: ADC.11(AIN5) ; port ADC-CH5
ADC-CH6: ADC.15(AIN6) ; port ADC-CH6
ADC-CH7: ADC.1(AIN7) ; port ADC-CH7
ADC-CH8: ADC.2(AIN8) ; port ADC-CH8
ADC-RESET: ADC.19(~{RESET}) ; port ADC-RESET
SPI-CLK: ADC.20(SCLK) ; port SPI-CLK
SPI-CS: ADC.21(~{CS}) ; port SPI-CS
SPI-MISO: ADC.23(DOUT) ; port SPI-MISO
SPI-MOSI: ADC.24(DIN) ; port SPI-MOSI
VREF: ADC.6(REFIN1(+)) ; port VREF
NetADC_27: ADC.27(XTAL2) C301.1 XTAL301.2
NetADC_28: ADC.28(XTAL1) C302.2 XTAL301.1

Not connected (* = marked no-connect by the designer): ADC 16(P2)* 18(P1)* 22(~{RDY})*

### Channels
SL/ADC: designators end in _ADC; ports ADC-CH1=NetTHERM6_2 ADC-CH2=NetTHERM5_2 ADC-CH3=NetTHERM4_2 ADC-CH4=NetADC_ADC_10 ADC-CH5=NetTHERM2_2 ADC-CH6=NetTHERM1_2 ADC-CH7=NetADC_ADC_1 ADC-CH8=NetADC_ADC_2 ADC-RESET=NetADC_ADC_19 MCU 3V Supply=3V3 Sensor Power Supply=A5V0 SPI-CLK=NetADC_ADC_20 SPI-CS=NetADC_ADC_21 SPI-MISO=NetADC_ADC_23 SPI-MOSI=NetADC_ADC_24 VREF=NetADC_ADC_6
SL/VOLT: designators end in _VOLT; ports ADC-CH1=A5V0 ADC-CH2=A5V0 ADC-CH3=A5V0 ADC-CH4=A5V0 ADC-CH5=A5V0 ADC-CH6=A5V0 ADC-CH7=NetADC_VOLT_1 ADC-CH8=NetADC_VOLT_2 ADC-RESET=NetADC_ADC_19 MCU 3V Supply=3V3 Sensor Power Supply=A5V0 SPI-CLK=NetADC_ADC_20 SPI-CS=NetADC_VOLT_21 SPI-MISO=NetADC_ADC_23 SPI-MOSI=NetADC_ADC_24 VREF=NetADC_VOLT_6

### Library data of the parts
ADC = CMP-0313-01290-2: 10 Channel 24-Bit Low Power Sigma-Delta Analog-to-Digital Converter with Serial, SPI Interface, 1.365KSPS, -40 to +85 degC, RW-28, Pb-Free, Tube; Generic Part Number: AD7718; Manufacturer: Analog Devices; Channels: 10; Throughput Rate (SPS): 1.365K; Interface: Ser, SPI; Resolution (Bits): 24; ComponentLink1URL: http://www.analog.com/en/index.html; ComponentLink2URL: http://www.analog.com/static/imported-files/data_sheets/AD7708_7718.pdf; Packing: Tube; ComponentLink4URL: http://www.analog.com/en/analog-to-digital-converters/ad-converters/ad7718/products/product.html; PackageDescription: 28-Lead Standard Small Outline Package [SOIC_W]; ComponentLink1Description: Manufacturer URL; ComponentLink2Description: Datasheet; PackageVersion: 060706-A; ComponentLink4Description: Product URL; ComponentLink3Description: Package Specification; ComponentLink3URL: http://www.analog.com/static/imported-files/packages/35833120341221RW_28.pdf; RoHS: Y; DatasheetVersion: Rev.0; PackageReference: RW-28; Mounting Technology: Surface Mount; PartNumber: AD7718BRZ; Code_JEDEC: MS-013-AE
C301 C302 = CC0603GRNPO9BN120: 12pF 50V
XTAL301 = CMP-0447-00001-4: Crystal 32.768kHz ±20ppm (Tol) 12.5pF FUND 70kΩ 2-Pin CSMD T/R; ESR (Equivalent Series Resistance): 70kR; Radiation Hardening: No; Frequency: 32.768kHz; Length: 3.2mm; Max Operating Temperature: 85°C; Number of Pins: 2; Series: ABS07; Min Operating Temperature: -40°C; Frequency Tolerance: 20ppm; Packaging: Tape and Reel; Height: 0.9mm; Width: 1.5mm; Depth: 1.5mm; Load Capacitance: 12.5pF; RoHS Compliant: Yes; Tolerance: 20ppm; Termination: SMD/SMT; Lead Free: Lead Free; Series Resistance: 70kR; REACH SVHC: No SVHC; Case/Package: CSMD; Operating Frequency: 32.768 kHz; Package Quantity: 3000

## Sheet VRB.SchDoc
size A; SheetNumber: 4; SheetTotal: 14
Used 2 times, as channels SL/VRB, SL/VRB. Parts and nets are listed once, with the designators drawn on the sheet.
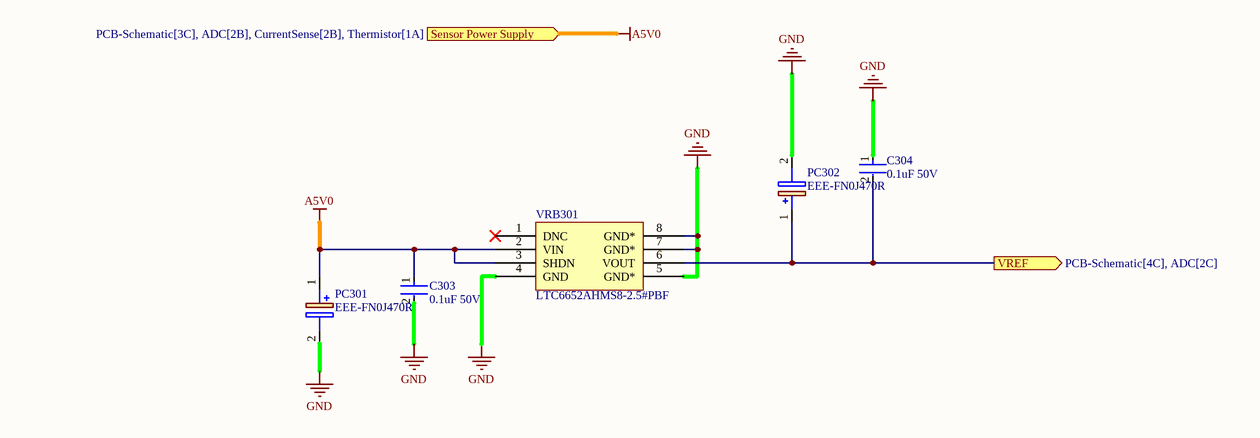
[diagram p7: VRB.SchDoc]

### Parts
C303  0.1uF 50V  [FP-CC0603-DA-MFG]
C304  0.1uF 50V  [FP-CC0603-DA-MFG]
PC301  EEE-FN0J470R  [EEE1AA220WR]
PC302  EEE-FN0J470R  [EEE1AA220WR]
VRB301  LTC6652AHMS8-2.5#PBF  [LTC6652AHMS8-2.5#PBF]

### Ports
Sensor Power Supply (in, see PCB-Schematic[3C], ADC[2B], CurrentSense[2B], Thermistor[1A]), VREF (out, see PCB-Schematic[4C], ADC[2C])

### Nets
A5V0: C303.1 PC301.1(+) VRB301.2(VIN) VRB301.3(SHDN) ; port Sensor Power Supply
GND: C303.2 C304.1 PC301.2(-) PC302.2(-) VRB301.4(GND) VRB301.5(GND*) VRB301.7(GND*) VRB301.8(GND*)
VREF: C304.2 PC302.1(+) VRB301.6(VOUT) ; port VREF

Not connected (* = marked no-connect by the designer): VRB301 1(DNC)*

### Channels
SL/VRB: designators end in _SL_VRB#1; ports Sensor Power Supply=A5V0 VREF=NetADC_ADC_6
SL/VRB: designators end in _SL_VRB#2; ports Sensor Power Supply=A5V0 VREF=NetADC_VOLT_6

### Library data of the parts
C303 C304 = CMP-03422-000468-1: CAP CER 0.1UF 50V X7R 0603; Manufacturer: YAGEO; Manufacturer Part Number: CC0603KPX7R9BB104; Temperature Coefficient: 15%; Capacitance: 100 nF; Material: Ceramic; Value: 100 nF; Tolerance: 0.1; Device Class L1: Passive Components; Temperature Range High: +125°C; ComponentLink2Description: Datasheet; Temperature Characteristic: X7R; Octopart: https://octopart.com/cc0603kpx7r9bb104-yageo-12885113; Height: 0.9mm; Mouser Description: Multilayer Ceramic Capacitors MLCC - SMD/SMT 100nF 50V X7R 10%; Device Class L3: Ceramic Capacitors; Voltage Rating: 50 V; Device Class L2: Capacitors; ComponentLink2URL: http://www.yageo.com/documents/recent/UPY-GPHC_X7R_6.3V-to-50V_18.pdf; Package: CC0603-DA; Automotive: No; Voltage: 50 V; RoHS: TRUE; Lead Free: Yes; Digikey Description: CAP CER 0.1UF 50V X7R 0603; Footprint Url: http://www.yageo.com/exep/pages/download/literatures/UPY-C_GEN_24.pdf; Temperature Range Low: -55°C; Temperature: -55°C to +125°C; Category: Cap
PC301 PC302 = EEE-FN0J470R: Capacitor Polarised; Manufacturer_Name: Panasonic; Datasheet Link: http://industrial.panasonic.com/cdbs/www-data/pdf/RDE0000/RDE0000C1259.pdf; Height: 5.5mm; Manufacturer_Part_Number: EEE-FN0J470R; Mouser Part Number: 667-EEE-FN0J470R; Mouser Price/Stock: https://www.mouser.co.uk/ProductDetail/Panasonic/EEE-FN0J470R?qs=OlC7AqGiEDnsjVsw6O9Inw%3D%3D; Arrow Part Number: EEE-FN0J470R; Arrow Price/Stock: https://www.arrow.com/en/products/eee-fn0j470r/panasonic

## Sheet CurrentSense.SchDoc
size A; SheetNumber: 6; SheetTotal: 14
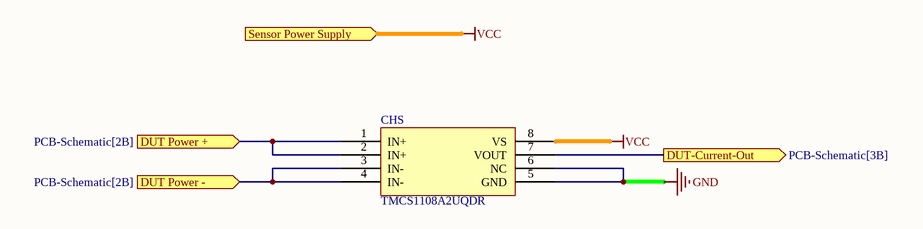
[diagram p8: CurrentSense.SchDoc]

### Parts
CHS  TMCS1108A2UQDR  [TMCS1108]

### Ports
DUT Power + (in, see PCB-Schematic[2B]), DUT Power - (in, see PCB-Schematic[2B]), DUT-Current-Out (out, see PCB-Schematic[3B]), Sensor Power Supply (in, see PCB-Schematic[2B], ADC[2B], Thermistor[1A], VRB[2B])

### Nets
GND: CHS.5(GND) CHS.6(NC)
VCC: CHS.8(VS) ; port Sensor Power Supply  [project net A5V0]
NetADC_ADC_1: CHS.7(VOUT) ; port DUT-Current-Out
NetADC_ADC_2: CHS.1(IN+) CHS.2(IN+) CHS.3(IN-) CHS.4(IN-) ; port DUT Power +, port DUT Power -

## Sheet HeatElement.SchDoc
size A; SheetNumber: 8; SheetTotal: 14
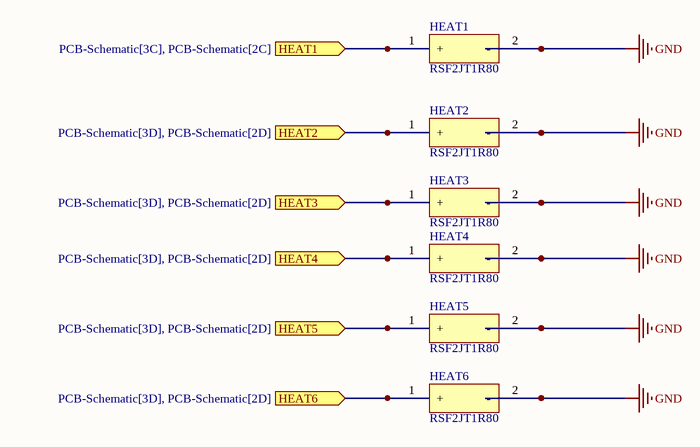
[diagram p9: HeatElement.SchDoc]

### Parts
HEAT1  RSF2JT1R80  [PCBComponent_1]
HEAT2  RSF2JT1R80  [PCBComponent_1]
HEAT3  RSF2JT1R80  [PCBComponent_1]
HEAT4  RSF2JT1R80  [PCBComponent_1]
HEAT5  RSF2JT1R80  [PCBComponent_1]
HEAT6  RSF2JT1R80  [PCBComponent_1]

### Ports
HEAT1 (in, see PCB-Schematic[3C], PCB-Schematic[2C]), HEAT2 (in, see PCB-Schematic[3D], PCB-Schematic[2D]), HEAT3 (in, see PCB-Schematic[3D], PCB-Schematic[2D]), HEAT4 (in, see PCB-Schematic[3D], PCB-Schematic[2D]), HEAT5 (in, see PCB-Schematic[3D], PCB-Schematic[2D]), HEAT6 (in, see PCB-Schematic[3D], PCB-Schematic[2D])

### Nets
GND: HEAT1.2(-) HEAT2.2(-) HEAT3.2(-) HEAT4.2(-) HEAT5.2(-) HEAT6.2(-)
NetC121_1: HEAT1.1(+) ; port HEAT1
NetC122_1: HEAT2.1(+) ; port HEAT2
NetC123_1: HEAT3.1(+) ; port HEAT3
NetC124_1: HEAT4.1(+) ; port HEAT4
NetC125_1: HEAT5.1(+) ; port HEAT5
NetC126_1: HEAT6.1(+) ; port HEAT6

### Library data of the parts
HEAT1-HEAT6 = Component_1

## Sheet Thermistor.SchDoc
size A; SheetNumber: 3; SheetTotal: 14
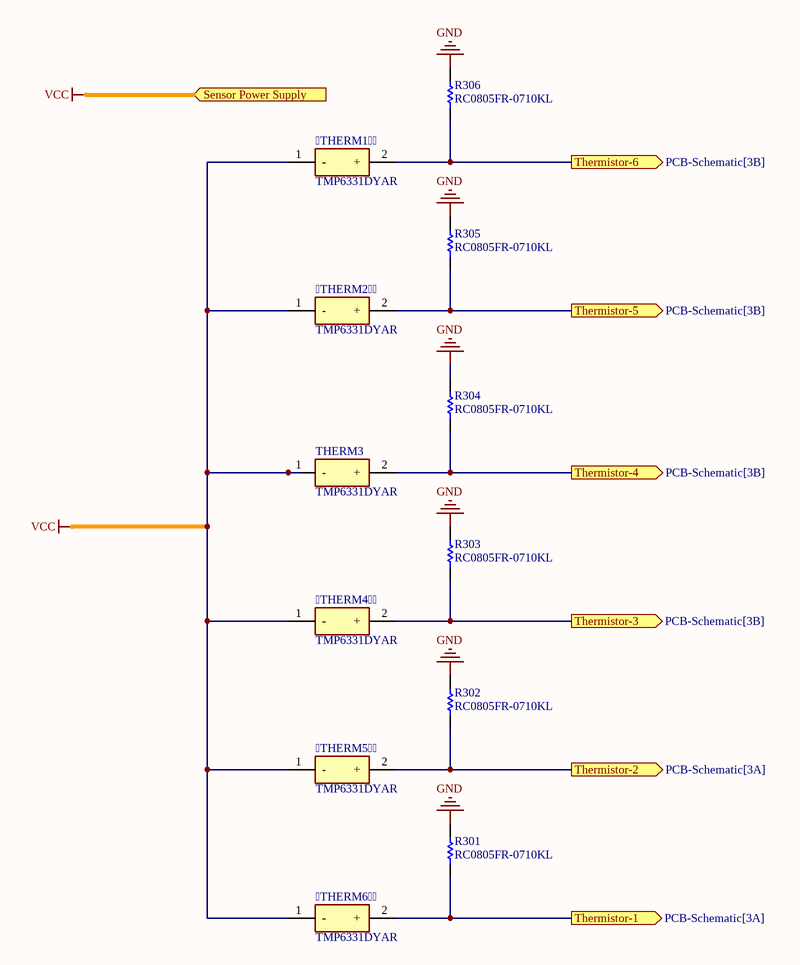
[diagram p10: Thermistor.SchDoc]

### Parts
THERM1  TMP6331DYAR  [TMP6331DYAR]
THERM2  TMP6331DYAR  [TMP6331DYAR]
THERM4  TMP6331DYAR  [TMP6331DYAR]
THERM5  TMP6331DYAR  [TMP6331DYAR]
THERM6  TMP6331DYAR  [TMP6331DYAR]
R301  RC0805FR-0710KL  [RESC2013X60X35NL10T20]
R302  RC0805FR-0710KL  [RESC2013X60X35NL10T20]
R303  RC0805FR-0710KL  [RESC2013X60X35NL10T20]
R304  RC0805FR-0710KL  [RESC2013X60X35NL10T20]
R305  RC0805FR-0710KL  [RESC2013X60X35NL10T20]
R306  RC0805FR-0710KL  [RESC2013X60X35NL10T20]
THERM3  TMP6331DYAR  [TMP6331DYAR]

### Ports
Sensor Power Supply (in, see PCB-Schematic[2A], ADC[2B], CurrentSense[2B], VRB[2B]), Thermistor-1 (out, see PCB-Schematic[3A]), Thermistor-2 (out, see PCB-Schematic[3A]), Thermistor-3 (out, see PCB-Schematic[3B]), Thermistor-4 (out, see PCB-Schematic[3B]), Thermistor-5 (out, see PCB-Schematic[3B]), Thermistor-6 (out, see PCB-Schematic[3B])

### Nets
GND: R301.2 R302.2 R303.2 R304.2 R305.2 R306.2
VCC: THERM1.1(-) THERM2.1(-) THERM4.1(-) THERM5.1(-) THERM6.1(-) THERM3.1(-) ; port Sensor Power Supply  [project net A5V0]
NetTHERM1_2: THERM1.2(+) R306.1 ; port Thermistor-6
NetTHERM2_2: THERM2.2(+) R305.1 ; port Thermistor-5
NetTHERM4_2: THERM4.2(+) R303.1 ; port Thermistor-3
NetTHERM5_2: THERM5.2(+) R302.1 ; port Thermistor-2
NetTHERM6_2: THERM6.2(+) R301.1 ; port Thermistor-1
NetADC_ADC_10: R304.1 THERM3.2(+) ; port Thermistor-4

### Library data of the parts
THERM1 THERM2 THERM4 THERM5 THERM6 THERM3 = TMP6331DYAR: PTC Thermistors +/-1% tolerance 100k linear thermistor available in an 0402 package 2-SOT-5X3 -40 to 150; Manufacturer_Name: Texas Instruments; Geometry.Height: 0.77mm; Mouser Part Number: 595-TMP6331DYAR; Mouser Price/Stock: https://www.mouser.co.uk/ProductDetail/Texas-Instruments/TMP6331DYAR?qs=7MVldsJ5UawI0UH0FIHgeA%3D%3D; Manufacturer_Part_Number: TMP6331DYAR; Datasheet Link: https://www.ti.com/lit/ds/symlink/tmp63.pdf?ts=1656390900860&ref_url=https%253A%252F%252Fwww.ti.com%252Fproduct%252FTMP63%252Fpart-details%252FTMP6331DYAR
R301-R306 = RC0805FR-0710KL: Chip Resistor, 10 KOhm, +/- 1%, 0.125 W, -55 to 155 degC, 0805 (2012 Metric), RoHS, Tape and Reel; Manufacturer: Yageo; Voltage Rating: 150 V; Mount: Surface Mount; ComponentLink1Description: Manufacturer URL; ComponentLink2URL: http://www.yageo.com/documents/recent/PYu-RC_Group_51_RoHS_L_04.pdf; Pins: 2; Length: 2 mm; Min Operating Temperature: -55 degC; Height: 0.5 mm; Mounting Technology: Surface Mount; RoHSCompliant: true; REACH SVHC: No SVHC; ComponentLink1URL: http://www.yageo.com/; Max Operating Temperature: 155 degC; PackageReference: 0805; DatasheetVersion: Rev. 4, 02/2016; Package Quantity: 5000; Packaging: Tape and Reel; ComponentLink2Description: Datasheet; PackageDescription: 2-Pin Surface Mounted Device, Body 2 x 1.25 mm

## Sheet Headers.SchDoc
size A; SheetNumber: 7; SheetTotal: 14
Used 6 times, as channels SL/DUT1, SL/DUT2, SL/DUT3, SL/DUT4, SL/DUT5, SL/DUT6. Parts and nets are listed once, with the designators drawn on the sheet.
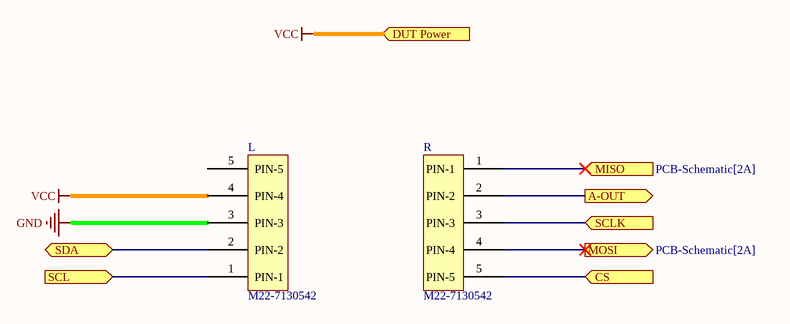
[diagram p11: Headers.SchDoc]

### Parts
L  M22-7130542  [RHDR5W50P0X200_1X5_1050X240X440P]
R  M22-7130542  [RHDR5W50P0X200_1X5_1050X240X440P]

### Ports
A-OUT (out, see PCB-Schematic[2A]), CS (in, see PCB-Schematic[2A]), DUT Power (in, see PCB-Schematic[1A]), MISO (in, see PCB-Schematic[2A]), MOSI (out, see PCB-Schematic[2A]), SCL (in, see PCB-Schematic[2A], OverviewRev2[4A], PCB-Schematic[2C]), SCLK (in, see PCB-Schematic[2A]), SDA (bidir, see PCB-Schematic[2A], OverviewRev2[4A], PCB-Schematic[2C])

### Nets
GND: L.3(PIN-3)
VCC: L.4(PIN-4) ; port DUT Power
A-OUT: R.2(PIN-2) ; port A-OUT
CS: R.5(PIN-5) ; port CS
MISO: R.1(PIN-1) ; port MISO
MOSI: R.4(PIN-4) ; port MOSI
SCL: L.1(PIN-1) ; port SCL
SCLK: R.3(PIN-3) ; port SCLK
SDA: L.2(PIN-2) ; port SDA

Not connected (* = marked no-connect by the designer): L 5(PIN-5)

### Channels
SL/DUT1: designators end in _DUT1; ports A-OUT=NetADC_ADC_2 CS=NetADC_VOLT_21 DUT Power=A5V0 MISO=NetADC_ADC_23 MOSI=NetADC_ADC_24 SCL=Pow.SCL SCLK=NetADC_ADC_20 SDA=Pow.SDA
SL/DUT2: designators end in _DUT2; ports A-OUT=NetADC_ADC_2 CS=NetADC_VOLT_21 DUT Power=A5V0 MISO=NetADC_ADC_23 MOSI=NetADC_ADC_24 SCL=Pow.SCL SCLK=NetADC_ADC_20 SDA=Pow.SDA
SL/DUT3: designators end in _DUT3; ports A-OUT=NetADC_ADC_2 CS=NetADC_VOLT_21 DUT Power=A5V0 MISO=NetADC_ADC_23 MOSI=NetADC_ADC_24 SCL=Pow.SCL SCLK=NetADC_ADC_20 SDA=Pow.SDA
SL/DUT4: designators end in _DUT4; ports A-OUT=NetADC_ADC_2 CS=NetADC_VOLT_21 DUT Power=A5V0 MISO=NetADC_ADC_23 MOSI=NetADC_ADC_24 SCL=Pow.SCL SCLK=NetADC_ADC_20 SDA=Pow.SDA
SL/DUT5: designators end in _DUT5; ports A-OUT=NetADC_ADC_2 CS=NetADC_VOLT_21 DUT Power=A5V0 MISO=NetADC_ADC_23 MOSI=NetADC_ADC_24 SCL=Pow.SCL SCLK=NetADC_ADC_20 SDA=Pow.SDA
SL/DUT6: designators end in _DUT6; ports A-OUT=NetADC_ADC_2 CS=NetADC_VOLT_21 DUT Power=A5V0 MISO=NetADC_ADC_23 MOSI=NetADC_ADC_24 SCL=Pow.SCL SCLK=NetADC_ADC_20 SDA=Pow.SDA